# EasyEDA Pro project Avian.epro

# Schematic Avian

## Sheets
1 Power and sensors: Board Name: Avian; Create Date: 2026-01-17; Page Name: Power and sensors; Project Name: Avian; Schematic Name: Avian; Update Date: 2026-01-23; Company: EasyEDA.com; Page Size: A4; Version: V1.0
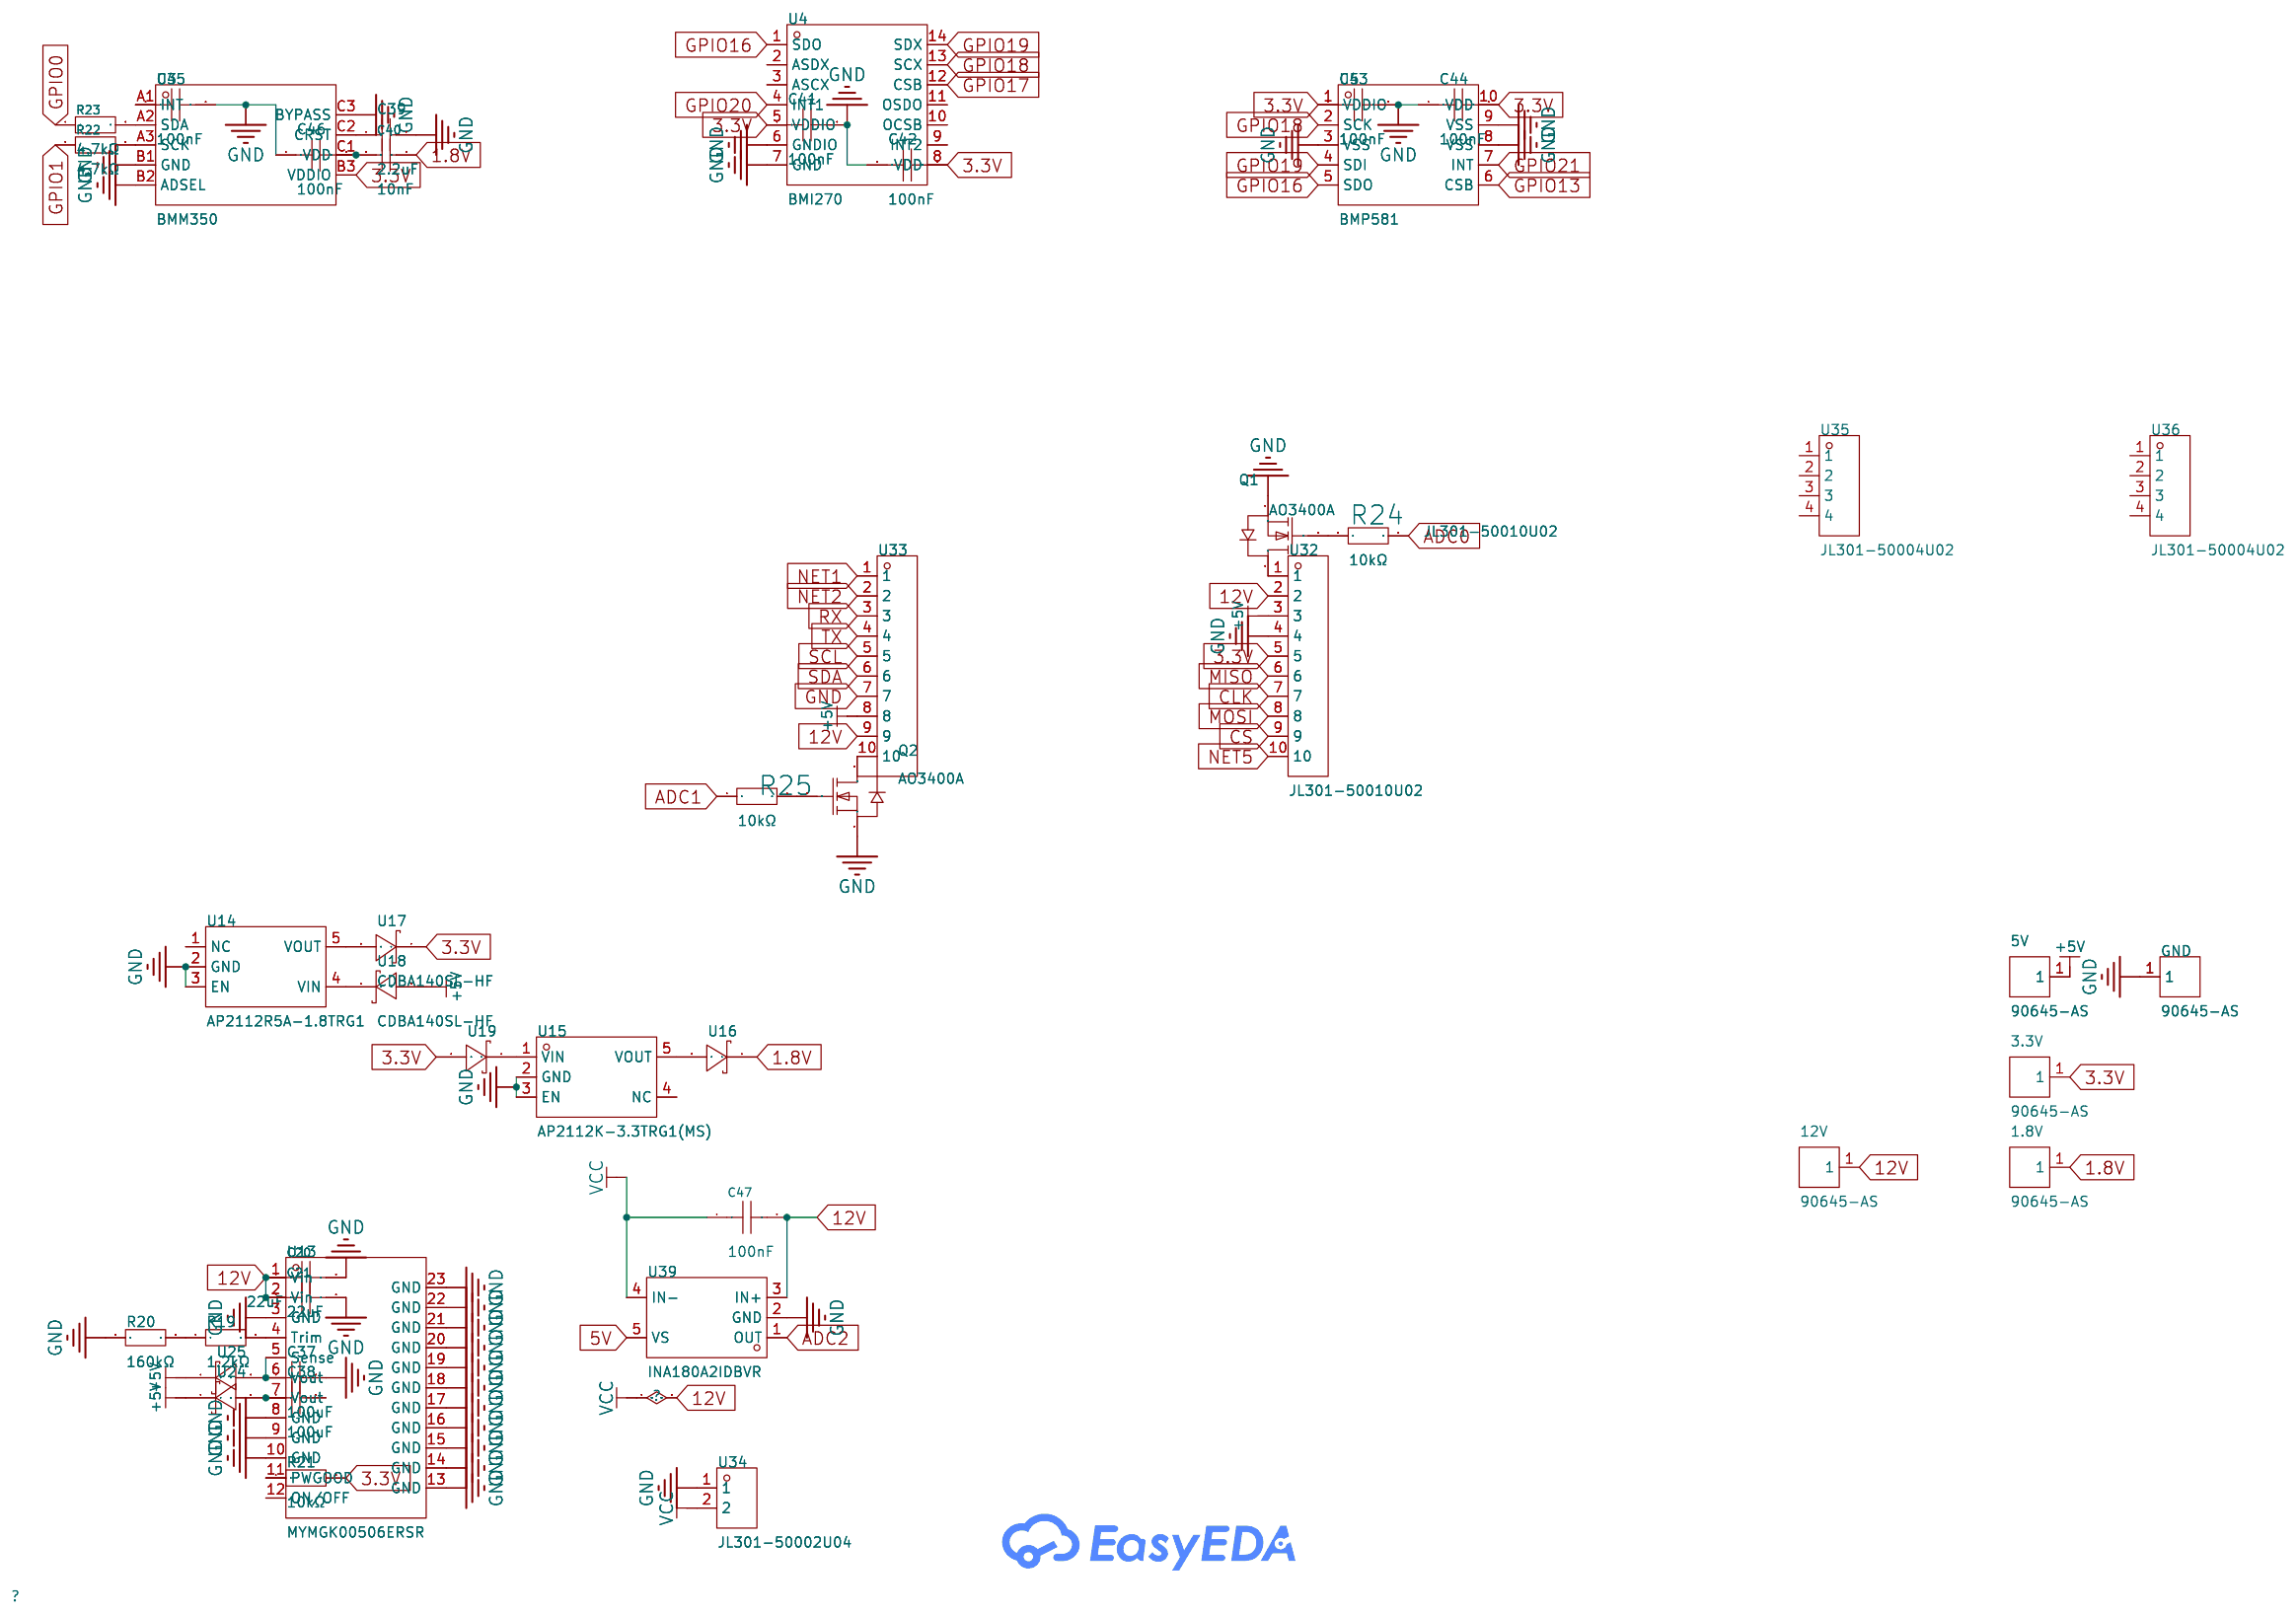
[diagram p0: Power and sensors]
2 MRPI: Create Date: 2026-01-18; Page Name: MRPI
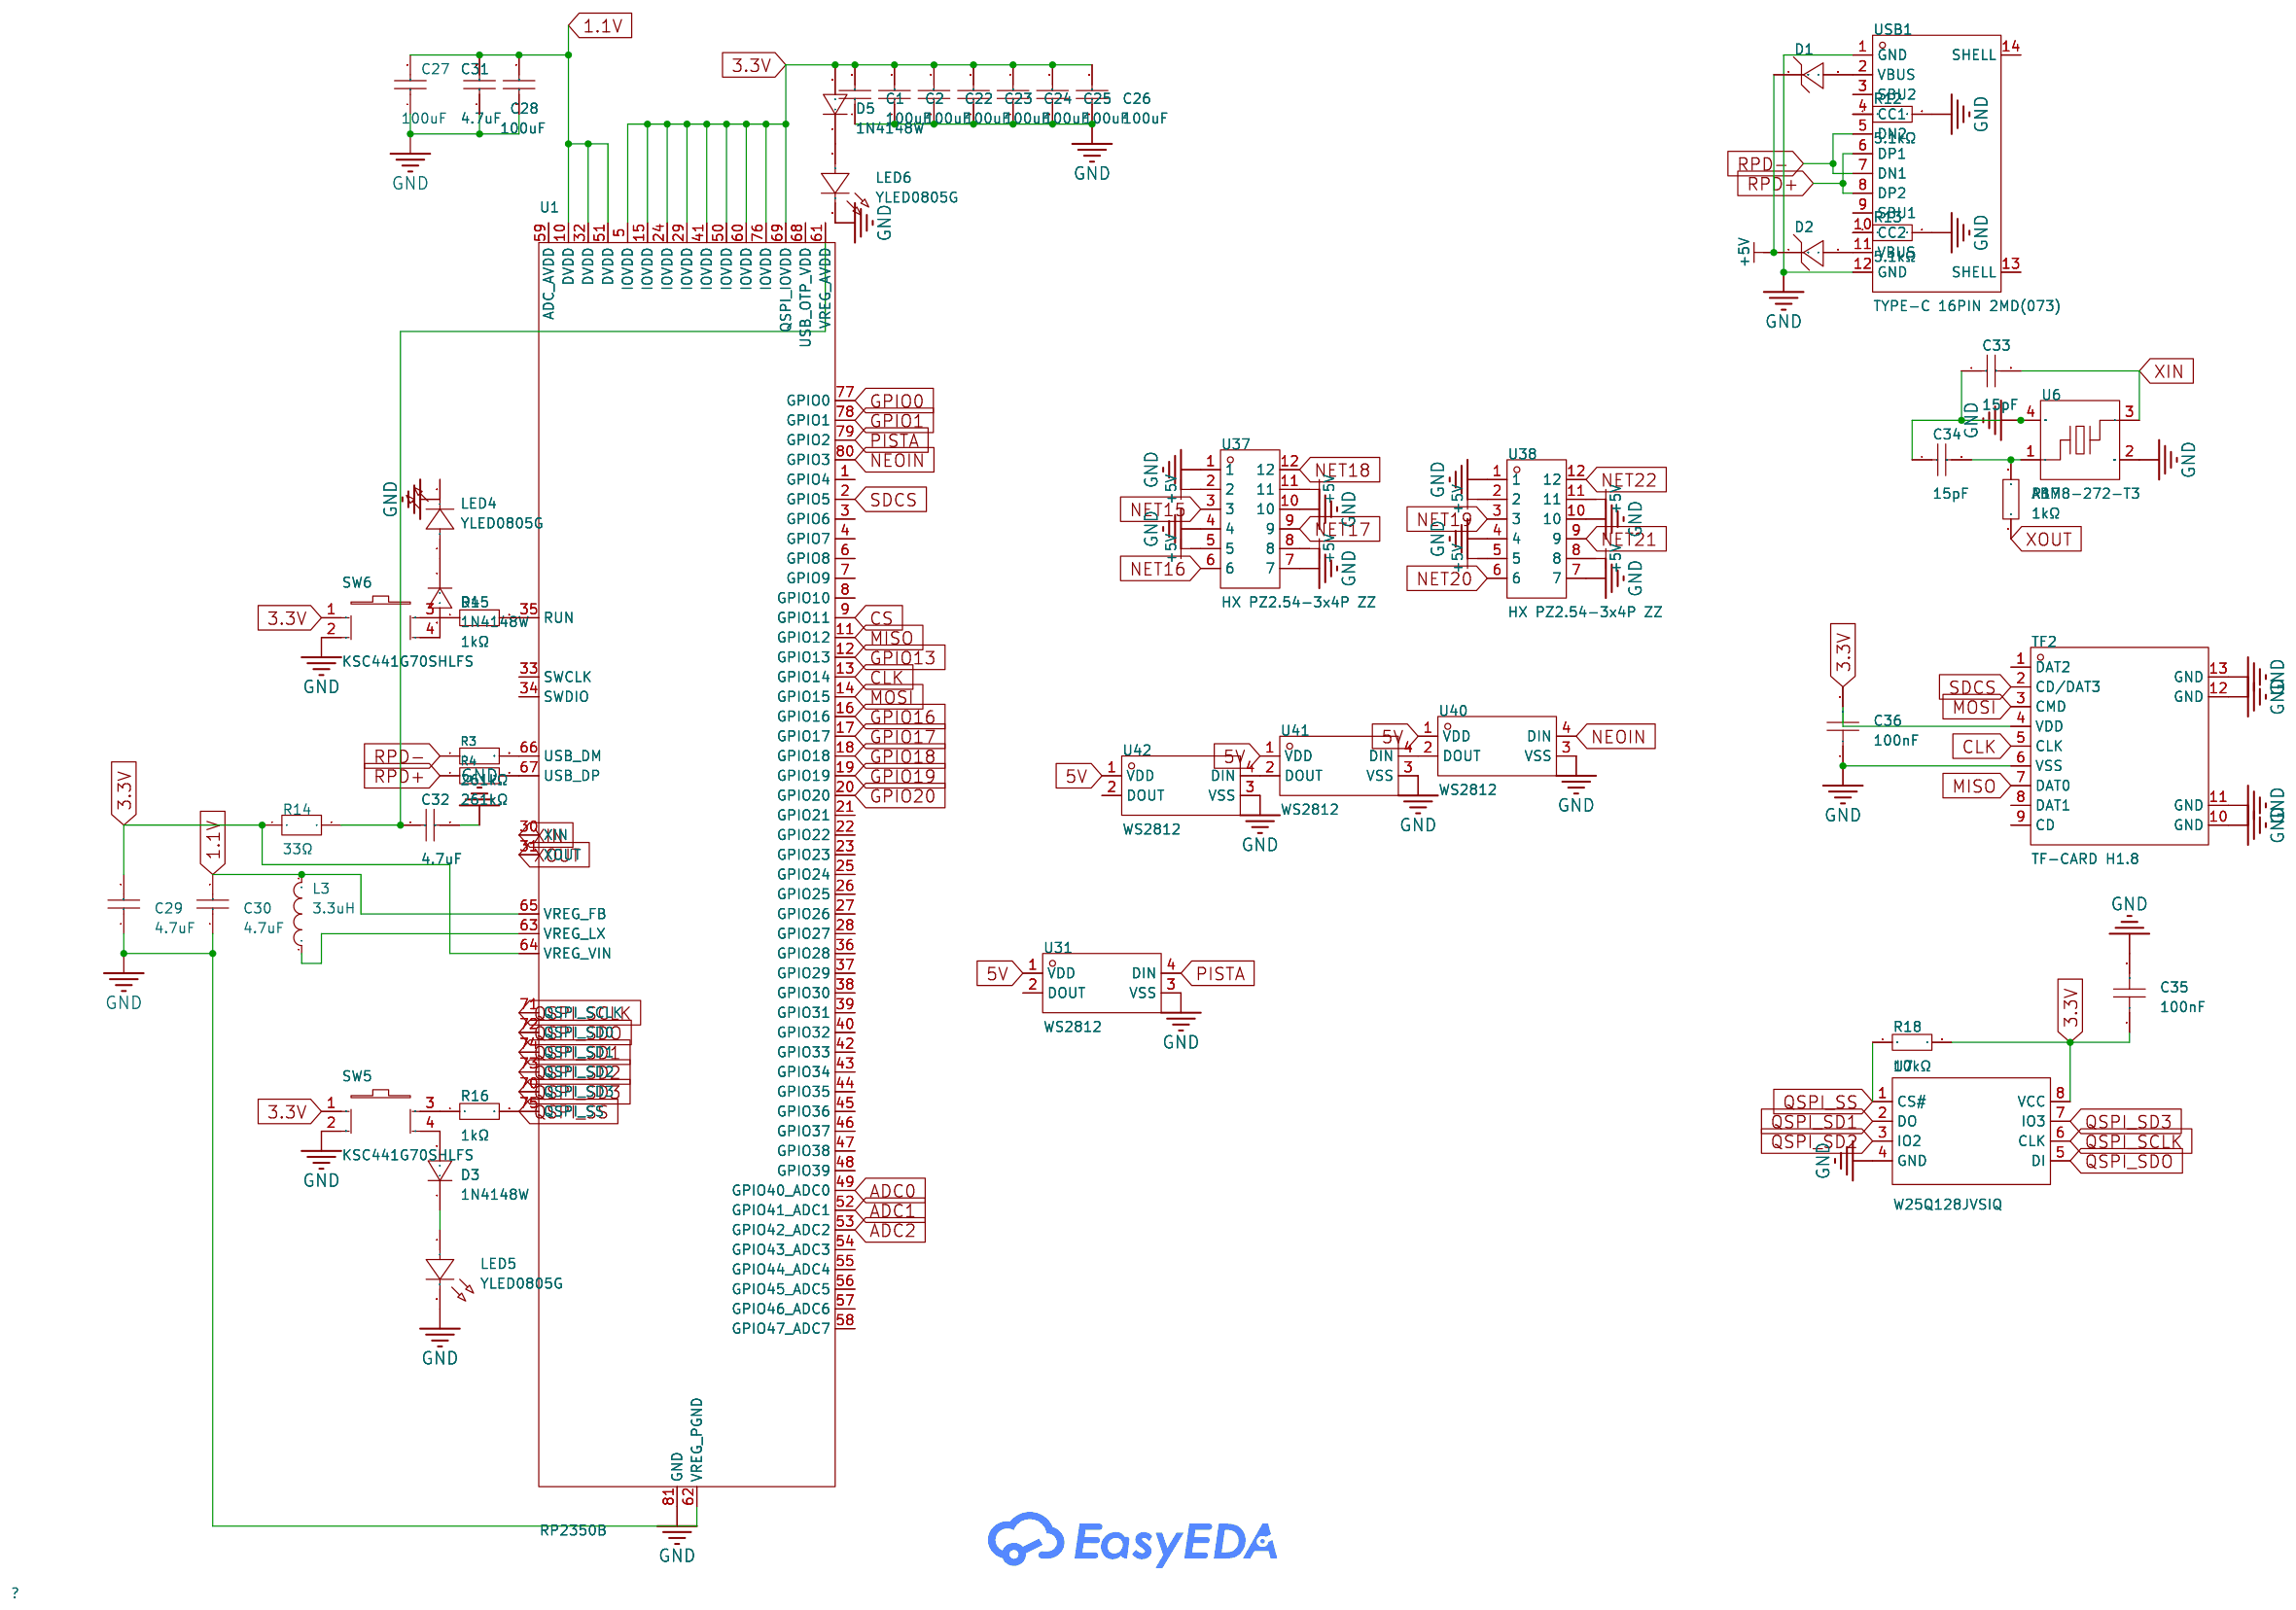
[diagram p1: MRPI]

## Parts
sheet MRPI
C1  100uF  [C1206]
C2  100uF  [C1206]
C22  100uF  [C1206]
C23  100uF  [C1206]
C24  100uF  [C1206]
C25  100uF  [C1206]
C26  100uF  [C1206]
C27  100uF  [C1206]
C28  100uF  [C1206]
C29  4.7uF  [C1206]
C30  4.7uF  [C1206]
C31  4.7uF  [C1206]
C32  4.7uF  [C1206]
C33  15pF  [C0603]
C34  15pF  [C0603]
C35  100nF  [C0603]
C36  100nF  [C0603]
D1  5.6V稳压管  [LL-34_L3.5-W1.5-RD]
D2  5.6V稳压管  [LL-34_L3.5-W1.5-RD]
D3  1N4148W  [SOD-123F_L2.7-W1.6-LS3.8-RD]
D4  1N4148W  [SOD-123F_L2.7-W1.6-LS3.8-RD]
D5  1N4148W  [SOD-123F_L2.7-W1.6-LS3.8-RD]
L3  3.3uH  [IND-SMD_L2.0-W1.6_AOTA-B201610S3R3-101-T]
LED4  YLED0805G  [LED0805-FD-GREEN]
LED5  YLED0805G  [LED0805-FD-GREEN]
LED6  YLED0805G  [LED0805-FD-GREEN]
R3  261kΩ  [R0603]
R4  261kΩ  [R0603]
R12  5.1kΩ  [R0805]
R13  5.1kΩ  [R0805]
R14  33Ω  [R0603]
R15  1kΩ  [R0603]
R16  1kΩ  [R0603]
R17  1kΩ  [R0603]
R18  10kΩ  [R0603]
SW5  KSC441G70SHLFS  [KEY--SMD_4P-L6.2-W6.2-P4.50-LS12.0]
SW6  KSC441G70SHLFS  [KEY--SMD_4P-L6.2-W6.2-P4.50-LS12.0]
TF2  TF-CARD H1.8  [TF-SMD_TF-CARD-H1.8]
U1  RP2350B  [QFN-80_L10.0-W10.0-P0.40-TL-EP3.4]
U6  ABM8-272-T3  [CRYSTAL-SMD_4P-L3.2-W2.5-BL]
U7  W25Q128JVSIQ  [SOIC-8_L5.3-W5.3-P1.27-LS8.0-BL]
U31  WS2812  [LED-SMD_4P-L5.0-W5.0-TL-A]
U37  HX PZ2.54-3x4P ZZ  [HDR-TH_12P-P2.54-V-M-R3-C4-S2.54]
U38  HX PZ2.54-3x4P ZZ  [HDR-TH_12P-P2.54-V-M-R3-C4-S2.54]
U40  WS2812  [LED-SMD_4P-L5.0-W5.0-TL-A]
U41  WS2812  [LED-SMD_4P-L5.0-W5.0-TL-A]
U42  WS2812  [LED-SMD_4P-L5.0-W5.0-TL-A]
USB1  TYPE-C 16PIN 2MD(073)  [USB-C-SMD_TYPE-C-6PIN-2MD-073]
sheet Power and sensors
1.8V  90645-AS  [SMD_BD1.8-H8.0]
3.3V  90645-AS  [SMD_BD1.8-H8.0]
5V  90645-AS  [SMD_BD1.8-H8.0]
12V  90645-AS  [SMD_BD1.8-H8.0]
C20  22uF  [C1210]
C21  22uF  [C1210]
C37  100uF  [C1206]
C38  100uF  [C1206]
C39  2.2uF  [C1206]
C40  10nF  [C0603]
C41  100nF  [C0603]
C42  100nF  [C0603]
C43  100nF  [C0603]
C44  100nF  [C0603]
C45  100nF  [C0603]
C46  100nF  [C0603]
C47  100nF  [C0603]
GND  90645-AS  [SMD_BD1.8-H8.0]
Q1  AO3400A  [SOT-23-3_L2.9-W1.3-P1.90-LS2.4-BR]
Q2  AO3400A  [SOT-23-3_L2.9-W1.3-P1.90-LS2.4-BR]
R19  1.2kΩ  [R0805]
R20  160kΩ  [R0603]
R21  10kΩ  [R0603]
R22  4.7kΩ  [R1206]
R23  4.7kΩ  [R1206]
R24  10kΩ  [R0603]
R25  10kΩ  [R0603]
U3  BMM350  [WLCSP-9_L1.3-W1.3-R3-C3-P0.40-TL]
U4  BMI270  [LGA-14_L3.0-W2.5-P0.50-BR]
U5  BMP581  [LGA-10_L2.0-W2.0-P0.50-TL_BMP581]
U13  MYMGK00506ERSR  [LGA-23_L9.0-W7.5_MYMGK00506ERSR]
U14  AP2112R5A-1.8TRG1  [SOT-89-5_L4.5-W2.5-P1.50-LS4.5-BR]
U15  AP2112K-3.3TRG1(MS)  [SOT-23-5_L2.9-W1.6-P0.95-LS2.7-BR]
U16  CDBA140SL-HF  [DO-214AC_L4.3-W2.7-LS5.3-RD]
U17  CDBA140SL-HF  [DO-214AC_L4.3-W2.7-LS5.3-RD]
U18  CDBA140SL-HF  [DO-214AC_L4.3-W2.7-LS5.3-RD]
U19  CDBA140SL-HF  [DO-214AC_L4.3-W2.7-LS5.3-RD]
U24  CDBA140SL-HF  [DO-214AC_L4.3-W2.7-LS5.3-RD]
U25  CDBA140SL-HF  [DO-214AC_L4.3-W2.7-LS5.3-RD]
U32  JL301-50010U02  [CONN-TH_10P-P5.00_JL301-50010U02]
U33  JL301-50010U02  [CONN-TH_10P-P5.00_JL301-50010U02]
U34  JL301-50002U04  [CONN-TH_JL301-50002U01]
U35  JL301-50004U02  [CONN-TH_4P-P5.00_JL301-50004U02]
U36  JL301-50004U02  [CONN-TH_4P-P5.00_JL301-50004U02]
U39  INA180A2IDBVR  [SOT-23-5_L3.0-W1.7-P0.95-LS2.8-BL]

## Library data of the parts
C1 C2 C22-C28 C37 C38 = CL31A107MQHNNNE: Capacitance:100uF Tolerance:±20% Tolerance:±20% Voltage Rating:6.3V Temperature Coefficient:X5R; LCSC Part Name: 100uF ±20% 6.3V; Supplier Part: C15008; Manufacturer: SAMSUNG(三星); Supplier Footprint: 1206; Datasheet: https://item.szlcsc.com/datasheet/CL31A107MQHNNNE/15681.html; Supplier: LCSC; Tolerance: ±20%; Voltage Rating: 6.3V; Temperature Coefficient: X5R
C29-C32 = CL31B475KBHNNNE: Capacitance:4.7uF Tolerance:±10% Tolerance:±10% Voltage Rating:50V Temperature Coefficient:X7R; LCSC Part Name: 4.7uF ±10% 50V; Supplier Part: C51205; Manufacturer: SAMSUNG(三星); Supplier Footprint: 1206; Datasheet: https://item.szlcsc.com/datasheet/CL31B475KBHNNNE/52218.html; Supplier: LCSC; Tolerance: ±10%; Voltage Rating: 50V; Temperature Coefficient: X7R
C33 C34 = CL10C150JB8NNNC: Capacitance:15pF Tolerance:±5% Tolerance:±5% Voltage Rating:50V Temperature Coefficient:C0G; LCSC Part Name: 15pF ±5% 50V; Supplier Part: C1644; Manufacturer: SAMSUNG(三星); Supplier Footprint: 0603; JLCPCB Part Class: Basic Part; Datasheet: https://item.szlcsc.com/datasheet/CL10C150JB8NNNC/1996.html; Supplier: LCSC; Tolerance: ±5%; Voltage Rating: 50V; Temperature Coefficient: C0G
C35 C36 C41-C46 = CC0603KRX7R9BB104: Capacitance:100nF Tolerance:±10% Tolerance:±10% Voltage Rating:50V Temperature Coefficient:X7R; LCSC Part Name: 100nF ±10% 50V; Supplier Part: C14663; Manufacturer: YAGEO(国巨); Supplier Footprint: 0603; Datasheet: https://item.szlcsc.com/datasheet/CC0603KRX7R9BB104/15331.html; Supplier: LCSC; Tolerance: ±10%; Voltage Rating: 50V; Temperature Coefficient: X7R
D1 D2 = 5.6V稳压管: Supplier Part: C9900004788; Supplier Footprint: LL34_L3.5-1.5; JLCPCB Part Class: Extended Part; Supplier: LCSC
D3-D5 = 1N4148W_C81598: Diode Configuration:Independent Voltage - Forward(Vf@If):1V@50mA Voltage - DC Reverse(Vr):75V Current - Rectified:150mA Pd - Power Dissipation:400mW Reverse Leakage Current (Ir):1uA@75V Reverse Recovery Time (trr):4ns Operating Junction Temperature Range:; Supplier Part: C81598; Manufacturer: ST(先科); Supplier Footprint: SOD-123; JLCPCB Part Class: Basic Part; Datasheet: https://item.szlcsc.com/datasheet/1N4148W/82750.html; Supplier: LCSC; Diode Configuration: Independent; Voltage - Forward(Vf@If): 1V@50mA; Voltage - DC Reverse(Vr): 75V; Current - Rectified: 150mA; Pd - Power Dissipation: 400mW; Reverse Leakage Current (Ir): 1uA@75V; Reverse Recovery Time (trr): 4ns; Non-Repetitive Peak Forward Surge Current: 1A
L3 = AOTA-B201610S3R3-101-T: Inductance:3.3uH Current Rating:2.1A Current - Saturation(Isat):2.4A DC Resistance(DCR):115mΩ Type:Molded Inductor; LCSC Part Name: 3.3uH 2.4A; Supplier Part: C42411119; Manufacturer: ABRACON; Supplier Footprint: 0806; JLCPCB Part Class: Extended Part; Datasheet: https://item.szlcsc.com/datasheet/AOTA-B201610S3R3-101-T/44392932.html; Supplier: LCSC; Current Rating: 2.1A; Current - Saturation(Isat): 2.4A; DC Resistance(DCR): 115mΩ; Type: Molded Inductor
LED4-LED6 = YLED0805G: Lamp Holder Type:-；- Illumination Color:Emerald Green Voltage - Forward(Vf):2.4V~3.1V Voltage - Forward(Vf):2.4V~3.1V Power(Watts):70mW Forward Current:20mA Wavelength - Dominant:516nm~534nm Wavelength - Dominant:516nm~534nm Peak Wavelength:525nm Diode Co; LCSC Part Name: 发光管; Supplier Part: C25170728; Manufacturer: YONGYUTAI(永裕泰); Supplier Footprint: 0805; JLCPCB Part Class: Extended Part; Datasheet: https://item.szlcsc.com/datasheet/YLED0805G/26899175.html; Supplier: LCSC; Lamp Holder Type: -；-; Illumination Color: Emerald Green; Voltage - Forward(Vf): 2.4V~3.1V; Power(Watts): 70mW; Forward Current: 20mA; Wavelength - Dominant: 516nm~534nm; Peak Wavelength: 525nm; Diode Configuration: -；-; Lens Color: -；-; Luminous Intensity: 430mcd; Viewing Angle: 120°; Mounting Style: -；-; Operating Temperature: -40℃~+85℃
R3 R4 = 0603WAF2613T5E: Type:Thick Film Resistors Resistance:261kΩ Tolerance:±1% Tolerance:±1% Power(Watts): Overload Voltage (Max): Temperature Coefficient:±100ppm/℃ Temperature Coefficient:±100ppm/℃ Operating Temperature Range:-55℃~+155℃ Operating Temperature Range:-55℃~+155℃; LCSC Part Name: 261kΩ ±1% 100mW 厚膜电阻; Supplier Part: C23011; Manufacturer: UNI-ROYAL(厚声); Supplier Footprint: 0603; JLCPCB Part Class: Extended Part; Datasheet: https://atta.szlcsc.com/upload/public/pdf/source/20200306/C422600_1E6D84923E4A46A82E41ADD87F860B5C.pdf; Supplier: LCSC; Type: Thick Film Resistors; Tolerance: ±1%; Temperature Coefficient: ±100ppm/℃; Operating Temperature Range: -55℃~+155℃
R12 R13 = 0805W8F5101T5E: Type:Thick Film Resistor Resistance:5.1kΩ Tolerance:±1% Tolerance:±1% Power(Watts):125mW Voltage-Supply(Max):150V Temperature Coefficient:±100ppm/℃ Temperature Coefficient:±100ppm/℃ Operating Temperature:-55℃~+155℃ Operating Temperature:-55℃~+155℃; LCSC Part Name: 5.1kΩ ±1% 125mW 厚膜电阻; Supplier Part: C27834; Manufacturer: UNI-ROYAL(厚声); Supplier Footprint: 0805; JLCPCB Part Class: Basic Part; Datasheet: https://item.szlcsc.com/datasheet/0805W8F5101T5E/28584.html; Supplier: LCSC; Type: Thick Film Resistor; Tolerance: ±1%; Power(Watts): 125mW; Voltage-Supply(Max): 150V; Temperature Coefficient: ±100ppm/℃; Operating Temperature: -55℃~+155℃
R14 = FRC0603F33R0TS: Type:Thick Film Resistor Resistance:33Ω Tolerance:±1% Tolerance:±1% Power(Watts):100mW Voltage-Supply(Max):75V Temperature Coefficient:±100ppm/℃ Temperature Coefficient:±100ppm/℃ Operating Temperature:-55℃~+155℃ Operating Temperature:-55℃~+155℃; LCSC Part Name: 33Ω ±1% 100mW 厚膜电阻; Supplier Part: C2909394; Manufacturer: FOJAN(富捷); Supplier Footprint: 0603; JLCPCB Part Class: Extended Part; Supplier: LCSC; Type: Thick Film Resistor; Tolerance: ±1%; Power(Watts): 100mW; Voltage-Supply(Max): 75V; Temperature Coefficient: ±100ppm/℃; Operating Temperature: -55℃~+155℃
R15-R17 = RC0603FR-071KL: Type:Thick Film Resistor Resistance:1kΩ Tolerance:±1% Tolerance:±1% Power(Watts):100mW Voltage-Supply(Max):75V Temperature Coefficient:±100ppm/℃ Temperature Coefficient:±100ppm/℃ Operating Temperature:-55℃~+155℃ Operating Temperature:-55℃~+155℃; LCSC Part Name: 厚膜电阻 1kΩ ±1% 100mW; Supplier Part: C22548; Manufacturer: YAGEO(国巨); Supplier Footprint: 0603; JLCPCB Part Class: Extended Part; Datasheet: https://item.szlcsc.com/datasheet/RC0603FR-071KL/23274.html; Supplier: LCSC; Type: Thick Film Resistor; Tolerance: ±1%; Power(Watts): 100mW; Voltage-Supply(Max): 75V; Temperature Coefficient: ±100ppm/℃; Operating Temperature: -55℃~+155℃
R18 R21 = RC0603FR-0710KL: Type:Thick Film Resistors Resistance: Tolerance:±1% Tolerance:±1% Power(Watts): Overload Voltage (Max): Temperature Coefficient:±100ppm/℃ Temperature Coefficient:±100ppm/℃ Operating Temperature Range:-55℃~+155℃ Operating Temperature Range:-55℃~+155℃; LCSC Part Name: 厚膜电阻 10kΩ ±1% 100mW; Supplier Part: C98220; Manufacturer: YAGEO(国巨); Supplier Footprint: 0603; JLCPCB Part Class: Extended Part; Datasheet: https://atta.szlcsc.com/upload/public/pdf/source/20180927/C295883_E8D83085EA81BD7DE0B2B681138C15EE.pdf; Supplier: LCSC; Type: Thick Film Resistors; Tolerance: ±1%; Temperature Coefficient: ±100ppm/℃; Operating Temperature Range: -55℃~+155℃
SW5 SW6 = KSC441G70SHLFS: Circuit:SPST Actuator Style:Round Button Operating Force:4N Mounting Type:Surface Mount,Vertical Length:6.2mm Width:6.2mm Switch Height:5.2mm Contact Current:50mA Voltage Rating:32V With Lamp:- IP Rating:IP67 Termination Style:Gull Wing Life:- Operating T; LCSC Part Name: 轻触开关6.2mm*6.2mm，4N; Supplier Part: C221747; Manufacturer: C&K; Supplier Footprint: SMD-4P,6.2x6.2mm; JLCPCB Part Class: Extended Part; Datasheet: https://item.szlcsc.com/datasheet/KSC441G70SHLFS/222177.html; Supplier: LCSC; Circuit: SPST; Actuator Style: Round Button; Operating Force: 4N; Mounting Type: Surface Mount,Vertical; Length: 6.2mm; Width: 6.2mm; Switch Height: 5.2mm; Contact Current: 50mA; Voltage Rating: 32V; IP Rating: IP67; Termination Style: Gull Wing; Operating Temperature: -40℃~+85℃
TF2 = TF-CARD H1.8: Card Connection Mode:Push-Push Card Type:MicroSD Card (TF Card) Connector Type:Connector and Ejector Additional Card Detection Pins:- Supplementary Features:- Height Above Board:1.8mm Operating Temperature:-40℃~+70℃ Operating Temperature:-40℃~+70℃; LCSC Part Name: 自弹式 MicroSD卡(TF卡) 卡座; Supplier Part: C7529389; Manufacturer: SHOU HAN(首韩); Supplier Footprint: SMD; Datasheet: https://item.szlcsc.com/datasheet/TF-CARD%2520H1.8/8629776.html; Supplier: LCSC; Card Connection Mode: Push-Push; Card Type: MicroSD Card (TF Card); Connector Type: Connector and Ejector; Height Above Board: 1.8mm; Operating Temperature: -40℃~+70℃
U1 = RP2350B_C42415655: LCSC Part Name: 微控制器; Supplier Part: C42415655; Manufacturer: Raspberry Pi(树莓派); Supplier Footprint: QFN-80-EP(10x10); JLCPCB Part Class: Extended Part; Datasheet: https://item.szlcsc.com/datasheet/RP2350B/44413055.html; Supplier: LCSC
U6 = ABM8-272-T3_C20625731: Supplier Part: C20625731; Manufacturer: ABRACON; Supplier Footprint: SMD3225-4P; JLCPCB Part Class: Extended Part; Datasheet: https://item.szlcsc.com/datasheet/ABM8-272-T3/22032038.html; Supplier: LCSC
U7 = W25Q128JVSIQ: Interface:SPI Memory Size:128Mbit Clock Frequency:133MHz Voltage - Supply:2.7V~3.6V Voltage - Supply:2.7V~3.6V Standby Supply Current:1uA Program / Erase Cycles:100,000 Cycles Page Programming Time (Tpp):3ms Block Erase Time(tBE):120ms@(32KB) Data Retenti; LCSC Part Name: 编带 支持双路/四路SPI接口的3V、128Mbit 串行闪存; Supplier Part: C97521; Manufacturer: Winbond(华邦); Supplier Footprint: SOIC-8-208mil; JLCPCB Part Class: Basic Part; Datasheet: https://item.szlcsc.com/datasheet/W25Q128JVSIQ/98729.html; Supplier: LCSC; Interface: SPI; Memory Size: 128Mbit; Clock Frequency: 133MHz; Voltage - Supply: 2.7V~3.6V; Standby Supply Current: 1uA; Program / Erase Cycles: 100,000 Cycles; Page Programming Time (Tpp): 3ms; Block Erase Time(tBE): 120ms@(32KB); Data Retention - TDR (Year): 20 Years; Operating Temperature: -40℃~+85℃
U31 U40-U42 = WS2812: Supplier Part: C42417498; Manufacturer: worldsemi; Supplier Footprint: SMD5050-4P; JLCPCB Part Class: Extended Part; Datasheet: https://item.szlcsc.com/datasheet/WS2812/44423158.html; Supplier: LCSC
U37 U38 = HX PZ2.54-3x4P ZZ: Pin Structure:3x4P Pitch:2.54mm Row Spacing:2.54mm Circluar Pins/Square Pins:Pin Header Mounting Type:Through Hole Number of Rows:3 Number of Pins:12P Current Rating:3A Voltage Rating (Max):1kV Length of Mating Pin:6mm Insulation Height:2.5mm Length of En; LCSC Part Name: 3x4P 间距:2.54mm 方针 直插; Supplier Part: C32713291; Manufacturer: hanxia(韩下); Supplier Footprint: 插件,P=2.54mm; JLCPCB Part Class: Extended Part; Datasheet: https://item.szlcsc.com/datasheet/HX%2520PZ2.54-3x4P%2520ZZ/34444571.html; Supplier: LCSC; Pin Structure: 3x4P; Pitch: 2.54mm; Row Spacing: 2.54mm; Circluar Pins/Square Pins: Pin Header; Mounting Type: Through Hole; Number of Rows: 3; Number of Pins: 12P; Current Rating: 3A; Voltage Rating (Max): 1kV; Length of Mating Pin: 6mm; Insulation Height: 2.5mm; Length of End Connection Pin: 3mm; Contact Material: Brass; Contact Plating: Gold; Operating Temperature: -40℃~+105℃; Color: Black
USB1 = TYPE-C 16PIN 2MD(073): Connector Type:Type-C Protocol Standard:- Gender:Female Mounting Type:Surface Mount, Right Angle Number of Contacts:16P Number of Ports:1 Current Rating-Power:3A Voltage Rating:5V Connect-Disconnect Life:5,000 Cycles Supplementary Features:- Center Height; LCSC Part Name: Type-C 母 卧贴; Supplier Part: C2765186; Manufacturer: SHOU HAN(首韩); Supplier Footprint: SMD; Datasheet: https://item.szlcsc.com/datasheet/TYPE-C%252016PIN%25202MD(073)/2901843.html; Supplier: LCSC; Connector Type: Type-C; Gender: Female; Mounting Type: Surface Mount, Right Angle; Number of Contacts: 16P; Number of Ports: 1; Current Rating-Power: 3A; Voltage Rating: 5V; Connect-Disconnect Life: 5,000 Cycles; Detection color: Black; Operating Temperature: -25℃~+85℃
1.8V 3.3V 5V 12V GND = 90645-AS: Supplier Part: C9900180202; Supplier Footprint: PAD; Supplier: LCSC
C20 C21 = GRM32ER71E226KE15L: Capacitance: Tolerance:±10% Tolerance:±10% Voltage Rated: Temperature Coefficient:; LCSC Part Name: 22uF ±10% 25V; Supplier Part: C21397; Manufacturer: muRata(村田); Supplier Footprint: 1210; JLCPCB Part Class: Extended Part; Datasheet: https://atta.szlcsc.com/upload/public/pdf/source/20230811/6AA9DB9766E5496748A2F980D0C94A94.pdf; Supplier: LCSC; Tolerance: ±10%
C39 = CL31B225KBHNNNE: Capacitance:2.2uF Tolerance:±10% Tolerance:±10% Voltage Rating:50V Temperature Coefficient:X7R; LCSC Part Name: 2.2uF ±10% 50V; Supplier Part: C50254; Manufacturer: SAMSUNG(三星); Supplier Footprint: 1206; Datasheet: https://item.szlcsc.com/datasheet/CL31B225KBHNNNE/51263.html; Supplier: LCSC; Tolerance: ±10%; Voltage Rating: 50V; Temperature Coefficient: X7R
C40 = CC0603KRX7R9BB103: Capacitance:10nF Tolerance:±10% Tolerance:±10% Voltage Rating:50V Temperature Coefficient:X7R; LCSC Part Name: 10nF ±10% 50V; Supplier Part: C100042; Manufacturer: YAGEO(国巨); Supplier Footprint: 0603; JLCPCB Part Class: Extended Part; Datasheet: https://item.szlcsc.com/datasheet/CC0603KRX7R9BB103/101256.html; Supplier: LCSC; Tolerance: ±10%; Voltage Rating: 50V; Temperature Coefficient: X7R
C47 = CL10B104KB8NNNC: Capacitance:100nF Tolerance:±10% Tolerance:±10% Voltage Rating:50V Temperature Coefficient:X7R; LCSC Part Name: 100nF ±10% 50V; Supplier Part: C1591; Manufacturer: SAMSUNG(三星); Supplier Footprint: 0603; JLCPCB Part Class: Extended Part; Datasheet: https://item.szlcsc.com/datasheet/CL10B104KB8NNNC/1943.html; Supplier: LCSC; Tolerance: ±10%; Voltage Rating: 50V; Temperature Coefficient: X7R
Q1 Q2 = AO3400A_C20917: Number:- Drain to Source Voltage:30V Current - Continuous Drain(Id):- RDS(on):48mΩ@2.5V Pd - Power Dissipation:- Gate Threshold Voltage (Vgs(th)):1.45V@250uA Gate Charge(Qg):7nC@10V Input Capacitance(Ciss):630pF@15V Reverse Transfer Capacitance (Crss@Vds); LCSC Part Name: 1个N沟道 耐压:30V 电流:5.7A; Supplier Part: C20917; Manufacturer: AOS; Supplier Footprint: SOT-23-3L; JLCPCB Part Class: Basic Part; Datasheet: https://item.szlcsc.com/datasheet/AO3400A/21629.html; Supplier: LCSC; Drain to Source Voltage: 30V; RDS(on): 48mΩ@2.5V; Gate Threshold Voltage (Vgs(th)): 1.45V@250uA; Gate Charge(Qg): 7nC@10V; Input Capacitance(Ciss): 630pF@15V; Operating Temperature: -55℃~+150℃@(Tj); Type: N-Channel
R19 = RC0805FR-071K2L: Type:Thick Film Resistors Resistance: Tolerance:±1% Tolerance:±1% Power(Watts): Overload Voltage (Max): Temperature Coefficient:±100ppm/℃ Temperature Coefficient:±100ppm/℃ Operating Temperature Range:-55℃~+155℃ Operating Temperature Range:-55℃~+155℃; LCSC Part Name: 厚膜电阻 1.2kΩ ±1% 125mW; Supplier Part: C114526; Manufacturer: YAGEO(国巨); Supplier Footprint: 0805; JLCPCB Part Class: Extended Part; Datasheet: https://atta.szlcsc.com/upload/public/pdf/source/20180821/C275644_0D56F95EFF785E7D9A1FEF436B37DA78.pdf; Supplier: LCSC; Type: Thick Film Resistors; Tolerance: ±1%; Temperature Coefficient: ±100ppm/℃; Operating Temperature Range: -55℃~+155℃
R20 = 0603WAF1603T5E: Type:Thick Film Resistor Resistance:160kΩ Tolerance:±1% Tolerance:±1% Power(Watts):100mW Voltage-Supply(Max):75V Temperature Coefficient:±100ppm/℃ Temperature Coefficient:±100ppm/℃ Operating Temperature:-55℃~+155℃ Operating Temperature:-55℃~+155℃; LCSC Part Name: 160kΩ ±1% 100mW 厚膜电阻; Supplier Part: C22813; Manufacturer: UNI-ROYAL(厚声); Supplier Footprint: 0603; Datasheet: https://item.szlcsc.com/datasheet/0603WAF1603T5E/23540.html; Supplier: LCSC; Type: Thick Film Resistor; Tolerance: ±1%; Power(Watts): 100mW; Voltage-Supply(Max): 75V; Temperature Coefficient: ±100ppm/℃; Operating Temperature: -55℃~+155℃
R22 R23 = RMC12064.7K1%N: Type:Thick Film Resistor Resistance:4.7kΩ Tolerance:±1% Tolerance:±1% Power(Watts):250mW Voltage-Supply(Max):200V Temperature Coefficient:±100ppm/℃ Temperature Coefficient:±100ppm/℃ Operating Temperature:-55℃~+155℃ Operating Temperature:-55℃~+155℃; LCSC Part Name: 厚膜电阻 4.7kΩ ±1% 250mW; Supplier Part: C269592; Manufacturer: Tyohm(幸亚电阻); Supplier Footprint: 1206; JLCPCB Part Class: Extended Part; Datasheet: https://item.szlcsc.com/datasheet/RMC12064.7K1%2525N/259032.html; Supplier: LCSC; Type: Thick Film Resistor; Tolerance: ±1%; Power(Watts): 250mW; Voltage-Supply(Max): 200V; Temperature Coefficient: ±100ppm/℃; Operating Temperature: -55℃~+155℃
R24 R25 = 0603WAF1002T5E: Type:Thick Film Resistor Resistance:10kΩ Tolerance:±1% Tolerance:±1% Power(Watts):100mW Voltage-Supply(Max):75V Temperature Coefficient:±100ppm/℃ Temperature Coefficient:±100ppm/℃ Operating Temperature:-55℃~+155℃ Operating Temperature:-55℃~+155℃; LCSC Part Name: 厚膜电阻 10kΩ ±1% 100mW; Supplier Part: C25804; Manufacturer: UNI-ROYAL(厚声); Supplier Footprint: 0603; JLCPCB Part Class: Basic Part; Datasheet: https://item.szlcsc.com/datasheet/0603WAF1002T5E/26547.html; Supplier: LCSC; Type: Thick Film Resistor; Tolerance: ±1%; Power(Watts): 100mW; Voltage-Supply(Max): 75V; Temperature Coefficient: ±100ppm/℃; Operating Temperature: -55℃~+155℃
U3 = BMM350_C17225907: LCSC Part Name: BMM350 转接板 3.0; Supplier Part: C17225907; Manufacturer: Bosch(博世); Supplier Footprint: WLCSP-9(1.3x1.3); JLCPCB Part Class: Extended Part; Datasheet: https://item.szlcsc.com/datasheet/BMM350/18354996.html; Supplier: LCSC
U4 = BMI270: Sensor Type:加速度计陀螺仪 Operating Temperature:-40℃~+85℃ Operating Temperature:-40℃~+85℃; Supplier Part: C2836813; Manufacturer: Bosch(博世); Supplier Footprint: LGA-14(2.5x3); Datasheet: https://atta.szlcsc.com/upload/public/pdf/source/20210625/C2836813_35E1F3F92097F45A3828DF13DDBA01A5.pdf; Supplier: LCSC; Sensor Type: 加速度计陀螺仪; Operating Temperature: -40℃~+85℃
U5 = BMP581: Pressure range:30Kpa~1.25bar Pressure range:30Kpa~1.25bar Voltage - Supply:1.71V~3.6V Voltage - Supply:1.71V~3.6V Standby Current:1uA Interface:I3C；SpI；I2C Operating Temperature:-40℃~+85℃ Operating Temperature:-40℃~+85℃ Relative Accuracy:6pa Temperature C; LCSC Part Name: 气压传感器; Supplier Part: C5362283; Manufacturer: Bosch(博世); Supplier Footprint: LGA-10(2x2); JLCPCB Part Class: Extended Part; Datasheet: https://item.szlcsc.com/datasheet/BMP581/6186766.html; Supplier: LCSC; Pressure range: 30Kpa~1.25bar; Voltage - Supply: 1.71V~3.6V; Standby Current: 1uA; Interface: I3C；SpI；I2C; Operating Temperature: -40℃~+85℃; Relative Accuracy: 6pa; Temperature Coefficient of Offset(TCO): 0.5pa/K
U13 = MYMGK00506ERSR: Supplier Part: C9900017943; Supplier Footprint: SMD; JLCPCB Part Class: Extended Part; Supplier: LCSC
U14 = AP2112R5A-1.8TRG1: Output Type:Fixed Voltage - Supply:6V Output Voltage:1.8V Output Voltage:1.8V Output Current:600mA Power Supply Rejection Ratio (PSRR):65dB@(1kHz) Voltage Dropout:500mV@(600mA) standby current:55uA Noise:50uVrms Operating Temperature:-40℃~+85℃ Operating T; Supplier Part: C5552981; Manufacturer: DIODES(美台); Supplier Footprint: SOT-89-5; JLCPCB Part Class: Extended Part; Datasheet: https://item.szlcsc.com/datasheet/AP2112R5A-1.8TRG1/6469193.html; Supplier: LCSC; Output Type: Fixed; Voltage - Supply: 6V; Output Voltage: 1.8V; Output Current: 600mA; Power Supply Rejection Ratio (PSRR): 65dB@(1kHz); Voltage Dropout: 500mV@(600mA); standby current: 55uA; Noise: 50uVrms; Operating Temperature: -40℃~+85℃; Output Configuration: Positive; Number of Outputs: 1
U15 = AP2112K-3.3TRG1(MS): Output Type:Fixed Voltage - Supply:6V Output Voltage:3.3V Output Voltage:3.3V Output Current:600mA Power Supply Rejection Ratio (PSRR):75dB@(1kHz) Voltage Dropout:- standby current:2uA Noise:- Features:Automatic Discharge Function；Low ESR；Overheat protect; Supplier Part: C22365427; Manufacturer: MSKSEMI(美森科); Supplier Footprint: SOT-23-5; Datasheet: https://item.szlcsc.com/datasheet/AP2112K-3.3TRG1(MS)/23832169.html; Supplier: LCSC; Output Type: Fixed; Voltage - Supply: 6V; Output Voltage: 3.3V; Output Current: 600mA; Power Supply Rejection Ratio (PSRR): 75dB@(1kHz); standby current: 2uA; Features: Automatic Discharge Function；Low ESR；Overheat protection；Overcurrent Protection；With ability; Operating Temperature: -40℃~+125℃@(Tj); Output Configuration: Positive electrode; Number of Outputs: 1
U16-U19 U24 U25 = CDBA140SL-HF: Diode Configuration:Independent Type Forward Voltage (Vf@If):270mV@1A Reverse Voltage (Vr):40V Rectified Current:1A Reverse Leakage Current (Ir):200uA@40V; LCSC Part Name: 电压:40V 电流:1A; Supplier Part: C3012747; Manufacturer: Comchip(典琦); Supplier Footprint: SMA(DO-214AC); JLCPCB Part Class: Extended Part; Datasheet: https://atta.szlcsc.com/upload/public/pdf/source/20220509/162A5C6B49991143F34B2FD163CA218E.pdf; Supplier: LCSC; Diode Configuration: Independent Type; Forward Voltage (Vf@If): 270mV@1A; Reverse Voltage (Vr): 40V; Rectified Current: 1A; Reverse Leakage Current (Ir): 200uA@40V
U32 U33 = JL301-50010U02: Number of Positions or Pins:1x10P Pitch:5mm Color:Blue Mounting Type:Through Hole Number of Pins:10P Number of Rows:1 Number of PINs Per Row:10 Screw Specification:M2.5 Current Rating:15A Voltage Rating (Max):300V Wire Gauge - AWG:12~24 Operating Temperat; LCSC Part Name: 1x10P 5mm 直插 排数:1 每排P数:10; Supplier Part: C409141; Manufacturer: JILN(锦凌); Supplier Footprint: 插件,P=5mm; JLCPCB Part Class: Extended Part; Datasheet: https://item.szlcsc.com/datasheet/JL301-50010U02/399071.html; Supplier: LCSC; Number of Positions or Pins: 1x10P; Pitch: 5mm; Color: Blue; Mounting Type: Through Hole; Number of Pins: 10P; Number of Rows: 1; Number of PINs Per Row: 10; Screw Specification: M2.5; Current Rating: 15A; Voltage Rating (Max): 300V; Wire Gauge - AWG: 12~24; Operating Temperature: -40℃~+105℃
U34 = JL301-50002U04: Number of Positions or Pins:1x2P Pitch:5mm Color:Blue Mounting Type:Through Hole Number of Pins:2P Number of Rows:1 Number of PINs Per Row:2 Screw Specification:M2.5 Current Rating:15A Voltage Rating (Max):300V Wire Gauge - AWG:12~24 Operating Temperature; LCSC Part Name: 1x2P 5mm 直插 排数:1 每排P数:2; Supplier Part: C1509679; Manufacturer: JILN(锦凌); Supplier Footprint: 插件,P=5mm; JLCPCB Part Class: Extended Part; Datasheet: https://item.szlcsc.com/datasheet/JL301-50002U04/1600353.html; Supplier: LCSC; Number of Positions or Pins: 1x2P; Pitch: 5mm; Color: Blue; Mounting Type: Through Hole; Number of Pins: 2P; Number of Rows: 1; Number of PINs Per Row: 2; Screw Specification: M2.5; Current Rating: 15A; Voltage Rating (Max): 300V; Wire Gauge - AWG: 12~24; Operating Temperature: -40℃~+105℃
U35 U36 = JL301-50004U02: Number of Positions or Pins:1x4P Pitch:5mm Color:Blue Mounting Type:Through Hole Number of Pins:4P Number of Rows:1 Screw Specification:M2.5 Current Rating:15A Voltage Rating (Max):300V Wire Gauge - AWG:12~24; LCSC Part Name: 1x4P 5mm 直插 排数:1; Supplier Part: C409137; Manufacturer: JILN(锦凌); Supplier Footprint: 插件,P=5mm; JLCPCB Part Class: Extended Part; Datasheet: https://item.szlcsc.com/datasheet/JL301-50004U02/399067.html; Supplier: LCSC; Number of Positions or Pins: 1x4P; Pitch: 5mm; Color: Blue; Mounting Type: Through Hole; Number of Pins: 4P; Number of Rows: 1; Screw Specification: M2.5; Current Rating: 15A; Voltage Rating (Max): 300V; Wire Gauge - AWG: 12~24
U39 = INA180A2IDBVR: Number of Channels:1 Vcm - Common Mode Voltage:-200mV~26V Vcm - Common Mode Voltage:-200mV~26V Gain:50V/V Bandwidth:210kHz Ib - Input Bias Current:100nA Vos - Input Offset Voltage:25uV Operating Temperature:-40℃~+125℃ Operating Temperature:-40℃~+125℃ Diff; Supplier Part: C192764; Manufacturer: TI(德州仪器); Supplier Footprint: SOT-23-5; JLCPCB Part Class: Extended Part; Datasheet: https://www.ti.com/cn/lit/gpn/ina180; Supplier: LCSC; Number of Channels: 1; Vcm - Common Mode Voltage: -200mV~26V; Gain: 50V/V; Bandwidth: 210kHz; Ib - Input Bias Current: 100nA; Vos - Input Offset Voltage: 25uV; Operating Temperature: -40℃~+125℃; Differential Voltage: -26V~+26V; Single Supply: 2.7V~5.5V; Quiescent Current: 197uA; Output Current: 8mA; Input Offset Voltage Drift(Vos TC): 1uV/℃; Input Offset Current(Ios): 50nA; Slew Rate: 2V/us; Common Mode Rejection Ratio (CMRR): 100dB; Noise density(eN): 40nV/√Hz

## Nets
1.1V: C27.2 C28.2 C30.2 C31.2 L3.2 U1.10(DVDD) U1.32(DVDD) U1.51(DVDD) U1.65(VREG_FB)
1.8V: 1.8V.1 C40.2 U16.1
3.3V: 3.3V.1 C1.2 C2.2 C22.2 C23.2 C24.2 C25.2 C26.2 C29.2 C35.1 C36.2 C41.1 C42.2 C43.1 C44.2 D5.2(A) R14.1 R18.2 R21.2 SW5.1 SW6.1 TF2.4(VDD) U1.5(IOVDD) U1.15(IOVDD) U1.24(IOVDD) U1.29(IOVDD) U1.41(IOVDD) U1.50(IOVDD) U1.60(IOVDD) U1.64(VREG_VIN) U1.69(QSPI_IOVDD) U1.76(IOVDD) U3.B3(VDDIO) U4.5(VDDIO) U4.8(VDD) U5.1(VDDIO) U5.10(VDD) U7.8(VCC) U17.1 U19.2 U32.5
5V: U31.1(VDD) U39.5(VS) U40.1(VDD) U41.1(VDD) U42.1(VDD)
+5V: 5V.1 D1.1(C) D2.1(C) U18.2 U24.1 U25.1 U32.3 U33.8 U37.2 U37.5 U37.8 U37.11 U38.2 U38.5 U38.8 U38.11
GND: C1.1 C2.1 C20.2 C21.2 C22.1 C23.1 C24.1 C25.1 C26.1 C27.1 C28.1 C29.1 C30.1 C31.1 C32.2 C33.1 C34.1 C35.2 C36.1 C37.2 C39.2 C41.2 C42.1 C43.2 C44.1 C45.2 C46.1 GND.1 LED4.2(K) LED5.2(K) LED6.2(K) Q1.2(S) Q2.2(S) R12.2 R13.2 R20.1 SW5.2 SW6.2 TF2.6(VSS) TF2.10(GND) TF2.11(GND) TF2.12(GND) TF2.13(GND) U1.62(VREG_PGND) U1.81(GND) U3.B1(GND) U3.B2(ADSEL) U3.C3(BYPASS) U4.6(GNDIO) U4.7(GND) U5.3(VSS) U5.8(VSS) U5.9(VSS) U6.2(GND) U6.4(GND) U7.4(GND) U13.3(GND) U13.8(GND) U13.9(GND) U13.10(GND) U13.13(GND) U13.14(GND) U13.15(GND) U13.16(GND) U13.17(GND) U13.18(GND) U13.19(GND) U13.20(GND) U13.21(GND) U13.22(GND) U13.23(GND) U14.2(GND) U14.3(EN) U15.2(GND) U15.3(EN) U31.3(VSS) U32.4 U33.7 U34.1 U37.1 U37.4 U37.7 U37.10 U38.1 U38.4 U38.7 U38.10 U39.2(GND) U40.3(VSS) U41.3(VSS) U42.3(VSS) USB1.1(GND) USB1.12(GND)
VCC: 12V.1 C20.1 C21.1 C47.1 C47.2 U13.1(Vin) U13.2(Vin) U32.2 U33.9 U34.2 U39.3(IN+) U39.4(IN-)
ADC0: R24.1 U1.49(GPIO40_ADC0)
ADC1: R25.1 U1.52(GPIO41_ADC1)
ADC2: U1.53(GPIO42_ADC2) U39.1(OUT)
CLK: TF2.5(CLK) U1.13(GPIO14) U32.7
CS: U1.9(GPIO11) U32.9
GPIO0: R23.1 U1.77(GPIO0)
GPIO1: R22.1 U1.78(GPIO1)
GPIO13: U1.12(GPIO13) U5.6(CSB)
GPIO16: U1.16(GPIO16) U4.1(SDO) U5.5(SDO)
GPIO17: U1.17(GPIO17) U4.12(CSB)
GPIO18: U1.18(GPIO18) U4.13(SCX) U5.2(SCK)
GPIO19: U1.19(GPIO19) U4.14(SDX) U5.4(SDI)
GPIO20: U1.20(GPIO20) U4.4(INT1)
GPIO21: U5.7(INT)
MISO: TF2.7(DAT0) U1.11(GPIO12) U32.6
MOSI: TF2.3(CMD) U1.14(GPIO15) U32.8
NEOIN: U1.80(GPIO3) U40.4(DIN)
NET1: U33.1
NET2: U33.2
NET5: U32.10
NET15: U37.3
NET16: U37.6
NET17: U37.9
NET18: U37.12
NET19: U38.3
NET20: U38.6
NET21: U38.9
NET22: U38.12
PISTA: U1.79(GPIO2) U31.4(DIN)
QSPI_SCLK: U1.71(QSPI_SCLK) U7.6(CLK)
QSPI_SD1: U1.74(QSPI_SD1) U7.2(DO)
QSPI_SD2: U1.73(QSPI_SD2) U7.3(IO2)
QSPI_SD3: U1.70(QSPI_SD3) U7.7(IO3)
QSPI_SDO: U1.72(QSPI_SD0) U7.5(DI)
QSPI_SS: R16.2 R18.1 U1.75(QSPI_SS) U7.1(CS#)
RPD+: R4.1 USB1.6(DP1) USB1.8(DP2)
RPD-: R3.1 USB1.5(DN2) USB1.7(DN1)
RX: U33.3
SCL: U33.5
SDA: U33.6
SDCS: TF2.2(CD/DAT3) U1.2(GPIO5)
TX: U33.4
XIN: C33.2 U1.30(XIN) U6.3
XOUT: R17.1 U1.31(XOUT)
$3N500: U15.5(VOUT) U16.2
$3N502: U14.5(VOUT) U17.2
$3N981: U14.4(VIN) U18.1
$3N1023: U15.1(VIN) U19.1
$3N2385: C38.1 U13.7(Vout) U24.2
$3N2422: C37.1 U13.5(Sense) U13.6(Vout) U25.2
$3N3774: R19.2 U13.4(Trim)
$3N3813: R19.1 R20.2
$3N4055: R21.1 U13.11(PWGOOD)
$3N4153: C39.1 U3.C2(CRST)
$3N4271: C40.1 C46.2 U3.C1(VDD)
$3N4404: R22.2 U3.A3(SCK)
$3N4443: R23.2 U3.A2(SDA)
$3N5055: C45.1 U3.A1(INT)
$3N10357: Q1.1(G) R24.2
$3N13570: Q2.3(D) U33.10
$3N13572: Q2.1(G) R25.2
$3N13582: Q1.3(D) U32.1
$5N665: D1.2(A) USB1.2(VBUS)
$5N667: D2.2(A) USB1.11(VBUS)
$5N714: R3.2 U1.66(USB_DM)
$5N753: R4.2 U1.67(USB_DP)
$5N865: R12.1 USB1.4(CC1)
$5N907: R13.1 USB1.10(CC2)
$5N1500: L3.1 U1.63(VREG_LX)
$5N1577: C32.1 R14.2 U1.61(VREG_AVDD)
$5N3555: R15.2 U1.35(RUN)
$5N4153: D4.1(K) LED4.1(A)
$5N4199: D3.1(K) LED5.1(A)
$5N4367: D5.1(K) LED6.1(A)
$5N4916: C34.2 R17.2 U6.1
$5N10092: R16.1 SW5.3
$5N10100: D3.2(A) SW5.4
$5N12881: R15.1 SW6.3
$5N12933: D4.2(A) SW6.4
$5N18524: U40.2(DOUT) U41.4(DIN)
$5N18586: U41.2(DOUT) U42.4(DIN)

Not connected (* = marked no-connect by the designer): C38 2; TF2 1(DAT2) 8(DAT1) 9(CD); U1 1(GPIO4) 3(GPIO6) 4(GPIO7) 6(GPIO8) 7(GPIO9) 8(GPIO10) 21(GPIO21) 22(GPIO22) 23(GPIO23) 25(GPIO24) 26(GPIO25) 27(GPIO26) 28(GPIO27) 33(SWCLK) 34(SWDIO) 36(GPIO28) 37(GPIO29) 38(GPIO30) 39(GPIO31) 40(GPIO32) 42(GPIO33) 43(GPIO34) 44(GPIO35) 45(GPIO36) 46(GPIO37) 47(GPIO38) 48(GPIO39) 54(GPIO43_ADC3) 55(GPIO44_ADC4) 56(GPIO45_ADC5) 57(GPIO46_ADC6) 58(GPIO47_ADC7) 59(ADC_AVDD) 68(USB_OTP_VDD); U4 2(ASDX) 3(ASCX) 9(INT2) 10(OCSB) 11(OSDO); U13 12(ON/OFF); U14 1(NC); U15 4(NC); U31 2(DOUT); U35 1 2 3 4; U36 1 2 3 4; U42 2(DOUT); USB1 3(SBU2) 9(SBU1) 13(SHELL) 14(SHELL)

# Board PCB1
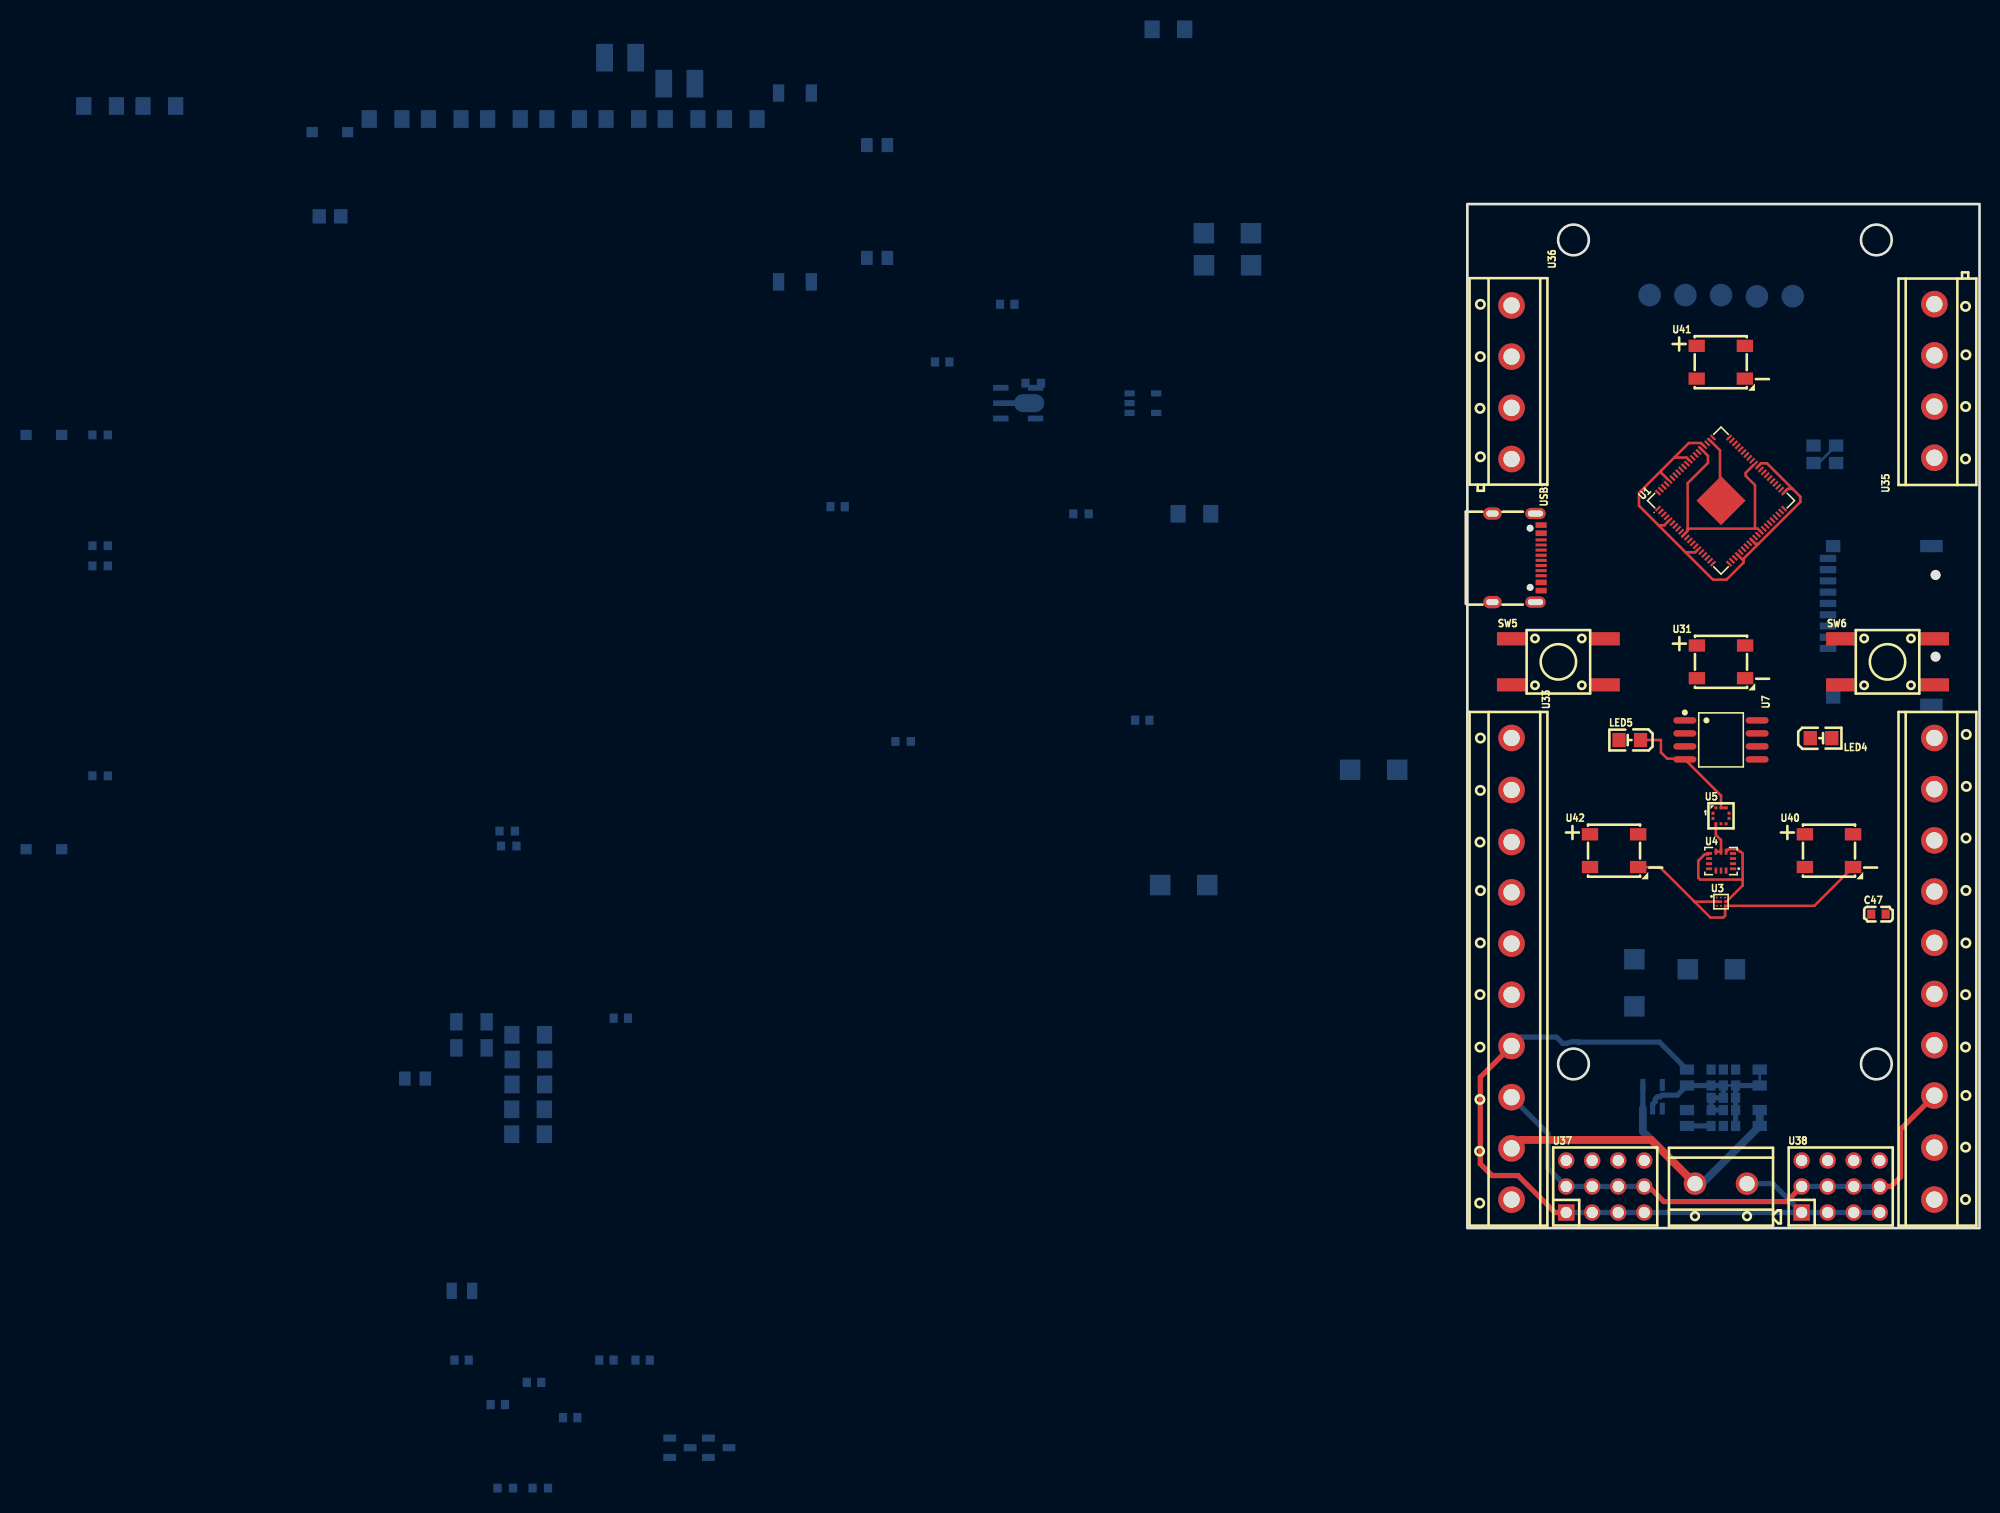
[diagram p2: board, top side]
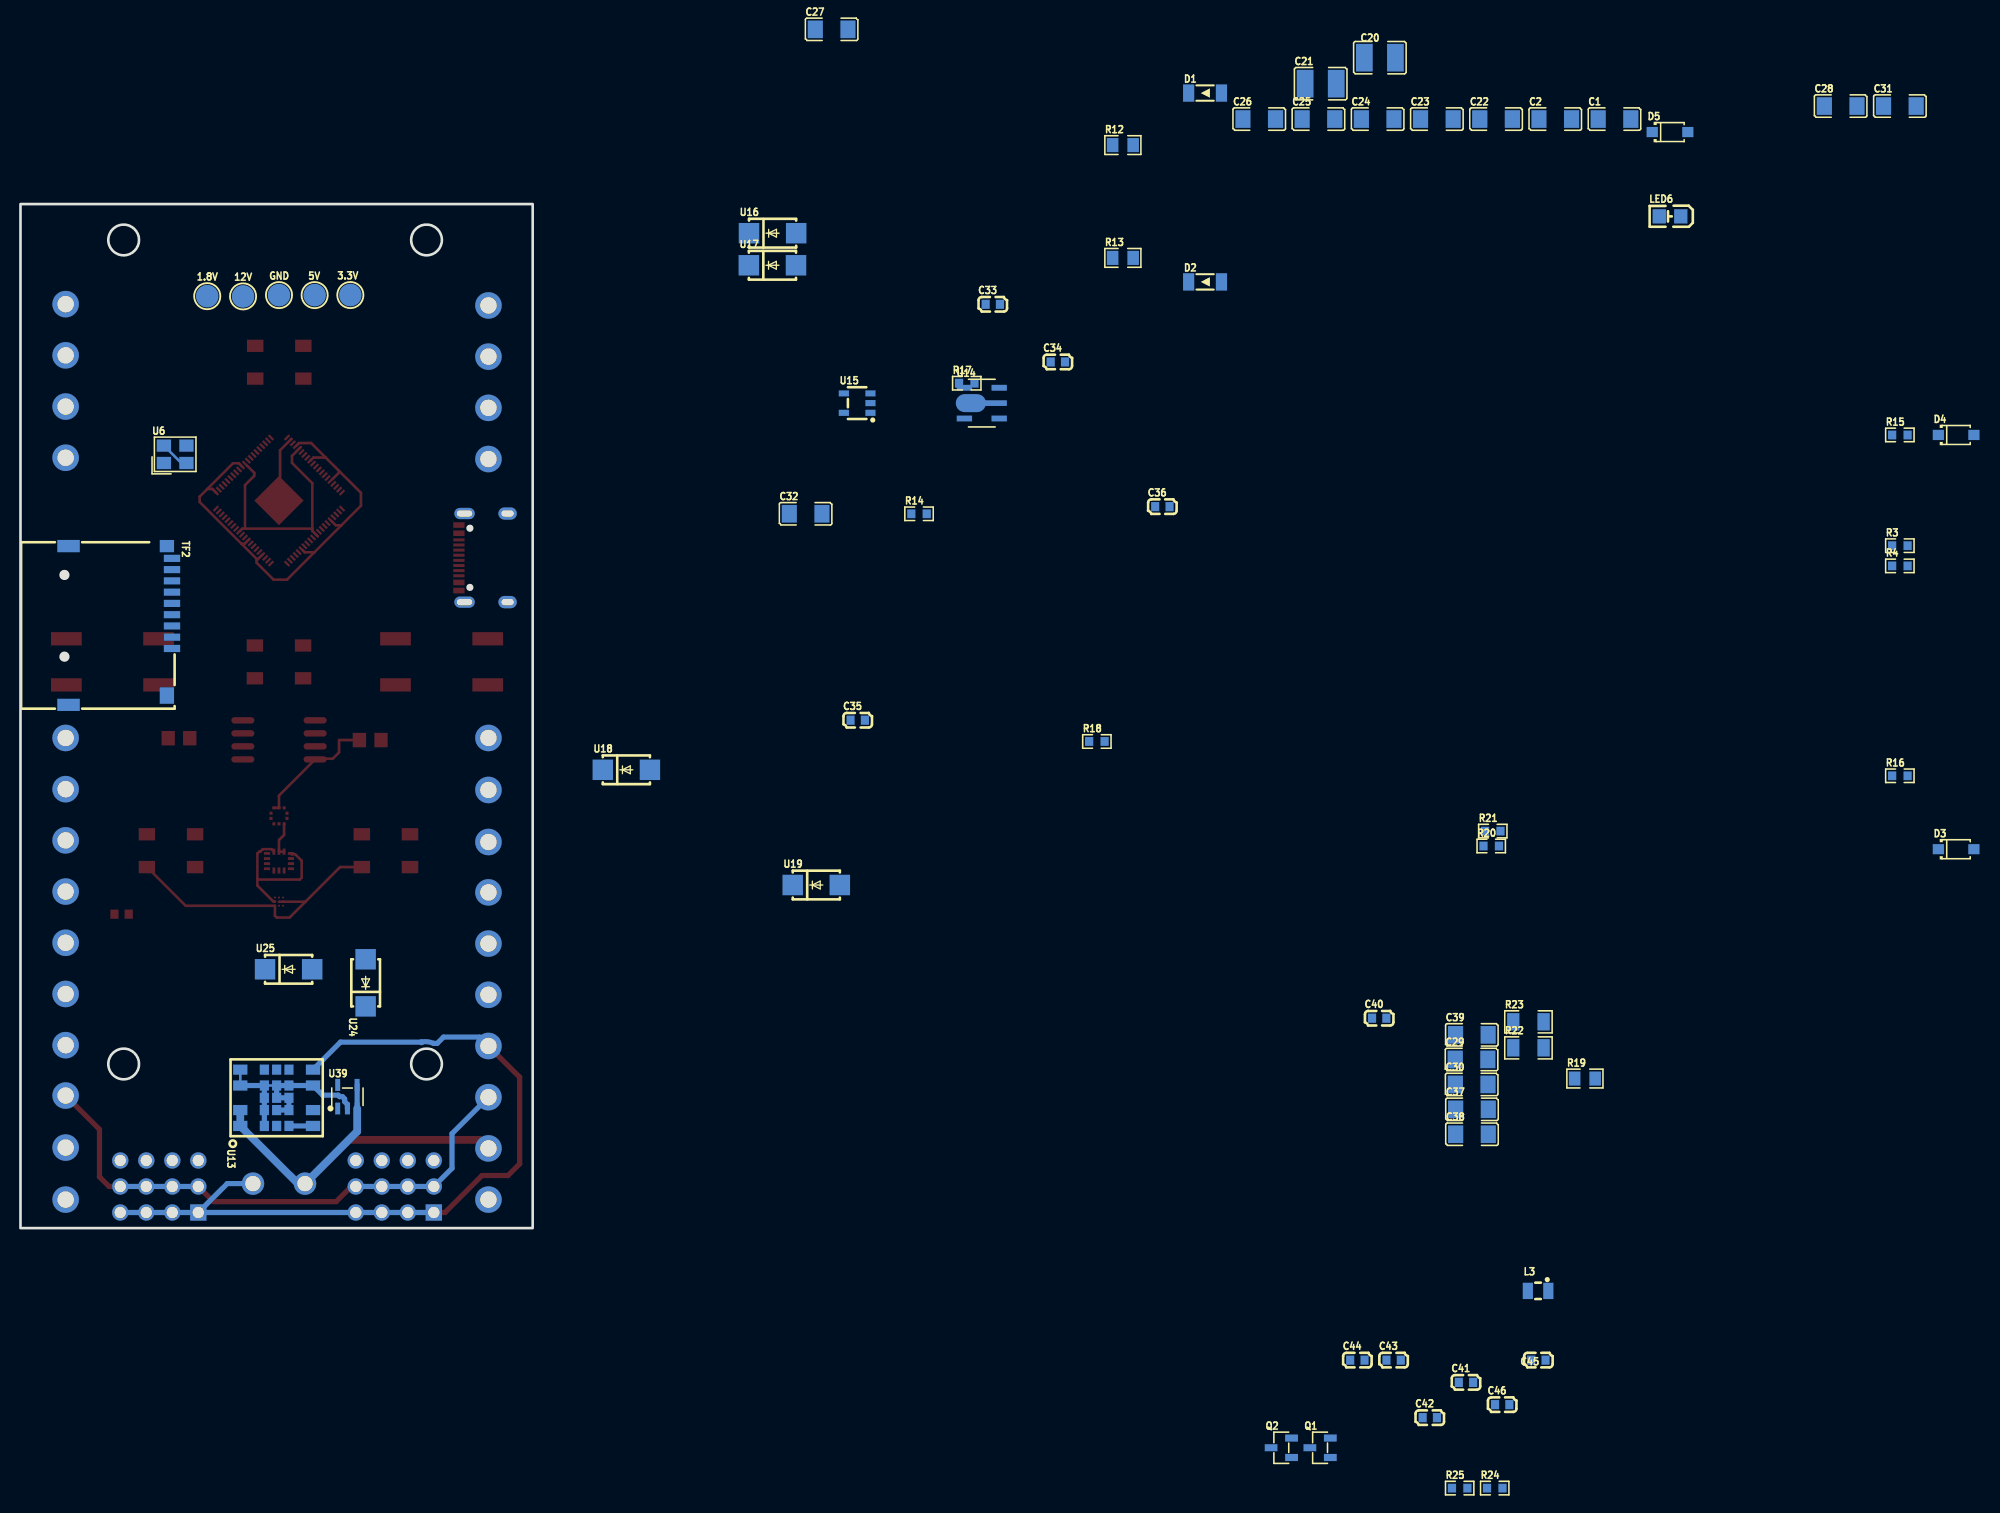
[diagram p3: board, bottom side, seen from below]

Outline 50 x 100 mm; copper layers: Top Layer, Inner1, Inner2, Bottom Layer. Coordinates in mm from the lower left corner of the outline.
Outline path: rectangle 0,100 50,0 ; circle c10.36,96.5 r1.5 ; circle c10.36,16.03 r1.5 ; circle c39.93,96.5 r1.5 ; circle c39.93,16.03 r1.5
Stack: Top Layer 0.035mm Outer layer thickness 1oz / Dielectric1 0.2104mm 7628 RC49% 8.6mil / Inner1 0.0152mm Inner layer thickness / Dielectric2 1.065mm 1.1mm H/HOZ Copper / Inner2 0.0152mm Inner layer thickness / Dielectric3 0.2104mm 7628 RC49% 8.6mil / Bottom Layer 0.035mm Outer layer thickness 1oz

## Design rules (mm)
template: JLCPCB Capability(Two Layers Board)
spacing copperThickness1oz (default): track to track 0.102, other pairs 0.152 to 0.3
spacing copperThickness2oz: track to track 0.203, other pairs 0.152 to 0.3
track width copperThickness1oz (default): min 0.127, default 0.254, max 2.54
track width copperThickness2oz: min 0.203, default 0.254, max 2.54
differential pair differentialPair (default): width min 0.127, default 0.254, max 2.54; gap min 0.152, default 0.152
via viaSize (default): diameter min 0.5, default 0.61, max 10; hole min 0.3, default 0.305, max 6.3

## Placement (name value [footprint] x y rotation side)
1.8V  90645-AS  [SMD_BD1.8-H8.0]  31.77 91.01 180 bottom
3.3V  90645-AS  [SMD_BD1.8-H8.0]  17.8 91.11 180 bottom
5V  90645-AS  [SMD_BD1.8-H8.0]  21.28 91.11 180 bottom
12V  90645-AS  [SMD_BD1.8-H8.0]  28.27 90.98 180 bottom
C1  100uF  [C1206]  -105.6 108.3 180 bottom
C2  100uF  [C1206]  -99.82 108.3 180 bottom
C20  22uF  [C1210]  -82.7 114.3 180 bottom
C21  22uF  [C1210]  -76.92 111.76 180 bottom
C22  100uF  [C1206]  -94.05 108.3 180 bottom
C23  100uF  [C1206]  -88.27 108.3 180 bottom
C24  100uF  [C1206]  -82.49 108.3 180 bottom
C25  100uF  [C1206]  -76.71 108.3 180 bottom
C26  100uF  [C1206]  -70.93 108.3 180 bottom
C27  100uF  [C1206]  -29.18 117.06 180 bottom
C28  100uF  [C1206]  -127.68 109.57 180 bottom
C29  4.7uF  [C1206]  -91.65 16.47 180 bottom
C30  4.7uF  [C1206]  -91.66 14.03 180 bottom
C31  4.7uF  [C1206]  -133.46 109.57 180 bottom
C32  4.7uF  [C1206]  -26.64 69.75 180 bottom
C33  15pF  [C0603]  -44.92 90.21 180 bottom
C34  15pF  [C0603]  -51.27 84.58 180 bottom
C35  100nF  [C0603]  -31.73 49.6 180 bottom
C36  100nF  [C0603]  -61.47 70.45 180 bottom
C37  100uF  [C1206]  -91.69 11.6 180 bottom
C38  100uF  [C1206]  -91.69 9.17 180 bottom
C39  2.2uF  [C1206]  -91.68 18.87 180 bottom
C40  10nF  [C0603]  -82.64 20.5 180 bottom
C41  100nF  [C0603]  -91.11 -15.07 180 bottom
C42  100nF  [C0603]  -87.58 -18.51 180 bottom
C43  100nF  [C0603]  -84.04 -12.89 180 bottom
C44  100nF  [C0603]  -80.51 -12.89 180 bottom
C45  100nF  [C0603]  -98.18 -12.89 180 bottom
C46  100nF  [C0603]  -94.64 -17.24 180 bottom
C47  100nF  [C0603]  40.13 30.66 0 top
D1  5.6V稳压管  [LL-34_L3.5-W1.5-RD]  -65.64 110.84 180 bottom
D2  5.6V稳压管  [LL-34_L3.5-W1.5-RD]  -65.64 92.4 180 bottom
D3  1N4148W  [SOD-123F_L2.7-W1.6-LS3.8-RD]  -138.95 37 180 bottom
D4  1N4148W  [SOD-123F_L2.7-W1.6-LS3.8-RD]  -138.95 77.45 180 bottom
D5  1N4148W  [SOD-123F_L2.7-W1.6-LS3.8-RD]  -111.03 107.03 180 bottom
GND  90645-AS  [SMD_BD1.8-H8.0]  24.76 91.11 180 bottom
L3  3.3uH  [IND-SMD_L2.0-W1.6_AOTA-B201610S3R3-101-T]  -98.14 -6.13 180 bottom
LED4  YLED0805G  [LED0805-FD-GREEN]  34.53 47.84 180 top
LED5  YLED0805G  [LED0805-FD-GREEN]  15.86 47.66 0 top
LED6  YLED0805G  [LED0805-FD-GREEN]  -111.03 98.8 180 bottom
Q1  AO3400A  [SOT-23-3_L2.9-W1.3-P1.90-LS2.4-BR]  -76.87 -21.45 180 bottom
Q2  AO3400A  [SOT-23-3_L2.9-W1.3-P1.90-LS2.4-BR]  -73.08 -21.45 180 bottom
R3  261kΩ  [R0603]  -133.46 66.64 180 bottom
R4  261kΩ  [R0603]  -133.46 64.67 180 bottom
R12  5.1kΩ  [R0805]  -57.62 105.76 180 bottom
R13  5.1kΩ  [R0805]  -57.62 94.74 180 bottom
R14  33Ω  [R0603]  -37.71 69.75 180 bottom
R15  1kΩ  [R0603]  -133.46 77.45 180 bottom
R16  1kΩ  [R0603]  -133.46 44.17 180 bottom
R17  1kΩ  [R0603]  -42.38 82.51 180 bottom
R18  10kΩ  [R0603]  -55.08 47.52 180 bottom
R19  1.2kΩ  [R0805]  -102.72 14.6 180 bottom
R20  160kΩ  [R0603]  -93.57 37.31 180 bottom
R21  10kΩ  [R0603]  -93.72 38.77 180 bottom
R22  4.7kΩ  [R1206]  -97.21 17.6 180 bottom
R23  4.7kΩ  [R1206]  -97.21 20.14 180 bottom
R24  10kΩ  [R0603]  -93.91 -25.39 180 bottom
R25  10kΩ  [R0603]  -90.49 -25.39 180 bottom
SW5  KSC441G70SHLFS  [KEY--SMD_4P-L6.2-W6.2-P4.50-LS12.0]  8.89 55.3 0 top
SW6  KSC441G70SHLFS  [KEY--SMD_4P-L6.2-W6.2-P4.50-LS12.0]  41.02 55.3 0 top
TF2  TF-CARD H1.8  [TF-SMD_TF-CARD-H1.8]  40.26 58.85 270 bottom
U1  RP2350B  [QFN-80_L10.0-W10.0-P0.40-TL-EP3.4]  24.76 71.04 45 top
U3  BMM350  [WLCSP-9_L1.3-W1.3-R3-C3-P0.40-TL]  24.76 31.88 0 top
U4  BMI270  [LGA-14_L3.0-W2.5-P0.50-BR]  24.76 35.84 0 top
U5  BMP581  [LGA-10_L2.0-W2.0-P0.50-TL_BMP581]  24.76 40.26 0 top
U6  ABM8-272-T3  [CRYSTAL-SMD_4P-L3.2-W2.5-BL]  34.9 75.56 180 bottom
U7  W25Q128JVSIQ  [SOIC-8_L5.3-W5.3-P1.27-LS8.0-BL]  24.76 47.68 270 top
U13  MYMGK00506ERSR  [LGA-23_L9.0-W7.5_MYMGK00506ERSR]  24.99 12.73 90 bottom
U14  AP2112R5A-1.8TRG1  [SOT-89-5_L4.5-W2.5-P1.50-LS4.5-BR]  -43.84 80.56 180 bottom
U15  AP2112K-3.3TRG1(MS)  [SOT-23-5_L2.9-W1.6-P0.95-LS2.7-BR]  -31.67 80.56 180 bottom
U16  CDBA140SL-HF  [DO-214AC_L4.3-W2.7-LS5.3-RD]  -23.42 97.16 180 bottom
U17  CDBA140SL-HF  [DO-214AC_L4.3-W2.7-LS5.3-RD]  -23.4 94.02 180 bottom
U18  CDBA140SL-HF  [DO-214AC_L4.3-W2.7-LS5.3-RD]  -9.14 44.75 180 bottom
U19  CDBA140SL-HF  [DO-214AC_L4.3-W2.7-LS5.3-RD]  -27.69 33.5 180 bottom
U24  CDBA140SL-HF  [DO-214AC_L4.3-W2.7-LS5.3-RD]  16.31 23.95 90 bottom
U25  CDBA140SL-HF  [DO-214AC_L4.3-W2.7-LS5.3-RD]  23.82 25.27 180 bottom
U31  WS2812  [LED-SMD_4P-L5.0-W5.0-TL-A]  24.76 55.3 0 top
U32  JL301-50010U02  [CONN-TH_10P-P5.00_JL301-50010U02]  45.59 25.32 90 top
U33  JL301-50010U02  [CONN-TH_10P-P5.00_JL301-50010U02]  4.32 25.32 270 top
U34  JL301-50002U04  [CONN-TH_JL301-50002U01]  24.76 4.34 180 top
U35  JL301-50004U02  [CONN-TH_4P-P5.00_JL301-50004U02]  45.59 82.73 90 top
U36  JL301-50004U02  [CONN-TH_4P-P5.00_JL301-50004U02]  4.32 82.6 270 top
U37  HX PZ2.54-3x4P ZZ  [HDR-TH_12P-P2.54-V-M-R3-C4-S2.54]  13.46 4.06 0 top
U38  HX PZ2.54-3x4P ZZ  [HDR-TH_12P-P2.54-V-M-R3-C4-S2.54]  36.45 4.06 0 top
U39  INA180A2IDBVR  [SOT-23-5_L3.0-W1.7-P0.95-LS2.8-BL]  18.09 12.83 180 bottom
U40  WS2812  [LED-SMD_4P-L5.0-W5.0-TL-A]  35.31 36.86 0 top
U41  WS2812  [LED-SMD_4P-L5.0-W5.0-TL-A]  24.74 84.56 0 top
U42  WS2812  [LED-SMD_4P-L5.0-W5.0-TL-A]  14.33 36.86 0 top
USB1  TYPE-C 16PIN 2MD(073)  [USB-C-SMD_TYPE-C-6PIN-2MD-073]  4.83 65.46 270 top

## Footprints (pads in the part's own frame, mm; a bottom-side part is the same pattern mirrored in y, then rotated)
C0603
  rect 0.8x0.9 smd: 1(-0.7,0) 2(0.7,0)
C1206
  rect 1.485x1.728 smd: 1(-1.593,0) 2(1.593,0)
C1210
  rect 1.635x2.7 smd: 1(-1.518,0) 2(1.518,0)
CONN-TH_4P-P5.00_JL301-50004U02
  round 2.6 hole 1.6: 1(-7.5,0) 2(-2.5,0) 3(2.5,0) 4(7.5,0)
CONN-TH_10P-P5.00_JL301-50010U02
  round 2.6 hole 1.6: 1(-22.54,0) 2(-17.46,0) 3(-12.38,0) 4(-7.46,0) 5(-2.46,0) 6(2.54,0) 7(7.54,0) 8(12.54,0) 9(17.54,0) 10(22.54,0)
CONN-TH_JL301-50002U01
  round 2.2 hole 1.5: 1(-2.54,0) 2(2.54,0)
CRYSTAL-SMD_4P-L3.2-W2.5-BL
  rect 1.4x1.2 smd: 1(-1.1,-0.85) 2(1.1,-0.85) 3(1.1,0.85) 4(-1.1,0.85)
DO-214AC_L4.3-W2.7-LS5.3-RD
  rect 2x2 smd: 1(-2.3,0) 2(2.3,0)
HDR-TH_12P-P2.54-V-M-R3-C4-S2.54
  rect 1.6x1.6 hole 1.1: 1(-3.81,-2.54)
  round 1.6 hole 1.1: 2(-3.81,0) 3(-3.81,2.54) 4(-1.27,-2.54) 5(-1.27,0) 6(-1.27,2.54) 7(1.27,-2.54) 8(1.27,0) 9(1.27,2.54) 10(3.81,-2.54) 11(3.81,0) 12(3.81,2.54)
IND-SMD_L2.0-W1.6_AOTA-B201610S3R3-101-T
  rect 1x1.6 smd: 1(-1,0) 2(1,0)
KEY--SMD_4P-L6.2-W6.2-P4.50-LS12.0
  rect 3x1.3 smd: 1(-4.5,2.25) 2(4.5,2.25) 3(-4.5,-2.25) 4(4.5,-2.25)
LED0805-FD-GREEN
  rect 1.3x1.399 smd: 1(-1.05,0) 2(1.05,0)
LED-SMD_4P-L5.0-W5.0-TL-A
  rect 1.6x1.2 smd: 1(-2.35,1.6) 2(-2.35,-1.6) 3(2.35,-1.6) 4(2.35,1.6)
LGA-10_L2.0-W2.0-P0.50-TL_BMP581
  rect 0.3x0.3 smd: 1(-0.78,0.25) 2(-0.78,-0.25) 3(-0.5,-0.78) 4(0,-0.78) 5(0.5,-0.78) 6(0.78,-0.25) 7(0.78,0.25) 8(0.5,0.78) 9(0,0.78) 10(-0.5,0.78)
LGA-14_L3.0-W2.5-P0.50-BR
  rect 0.6x0.27 smd: 1(1.17,-0.75) 2(1.17,-0.25) 3(1.17,0.25) 4(1.17,0.75) 8(-1.17,0.75) 9(-1.17,0.25) 10(-1.17,-0.25) 11(-1.17,-0.75)
  rect 0.27x0.6 smd: 5(0.5,0.92) 6(0,0.92) 7(-0.5,0.92) 12(-0.5,-0.92) 13(0,-0.92) 14(0.5,-0.92)
LGA-23_L9.0-W7.5_MYMGK00506ERSR
  rect 1x1.4 smd: 1(-2.75,3.55) 2(-1.2,3.55) 6(-2.75,-3.55) 7(-1.2,-3.55) 8(1.2,-3.55) 9(2.75,-3.55) 13(2.75,3.55) 14(1.2,3.55)
  rect 1x0.9 smd: 3(-2.75,1.2) 4(-2.75,0) 5(-2.75,-1.2) 10(2.75,-1.2) 11(2.75,0) 12(2.75,1.2) 15(-1.2,1.2) 16(-1.2,0) 17(-1.2,-1.2) 18(0,1.2) 19(0,0) 20(0,-1.2) 21(1.2,1.2) 22(1.2,0) 23(1.2,-1.2)
LL-34_L3.5-W1.5-RD
  rect 1.1x1.7 smd: 1(-1.6,0) 2(1.6,0)
QFN-80_L10.0-W10.0-P0.40-TL-EP3.4
  rect 0.665x0.22 smd: 1(-4.907,3.8) 2(-4.907,3.4) 3(-4.907,3) 4(-4.907,2.6) 5(-4.907,2.2) 6(-4.907,1.8) 7(-4.907,1.4) 8(-4.907,1) 9(-4.907,0.6) 10(-4.907,0.2) 11(-4.907,-0.2) 12(-4.907,-0.6) 13(-4.907,-1) 14(-4.907,-1.4) 15(-4.907,-1.8) 16(-4.907,-2.2) 17(-4.907,-2.6) 18(-4.907,-3) 19(-4.907,-3.4) 20(-4.907,-3.8) 41(4.907,-3.8) 42(4.907,-3.4) 43(4.907,-3) 44(4.907,-2.6) 45(4.907,-2.2) 46(4.907,-1.8) 47(4.907,-1.4) 48(4.907,-1) 49(4.907,-0.6) 50(4.907,-0.2) 51(4.907,0.2) 52(4.907,0.6) 53(4.907,1) 54(4.907,1.4) 55(4.907,1.8) 56(4.907,2.2) 57(4.907,2.6) 58(4.907,3) 59(4.907,3.4) 60(4.907,3.8)
  rect 0.22x0.665 smd: 21(-3.8,-4.907) 22(-3.4,-4.907) 23(-3,-4.907) 24(-2.6,-4.907) 25(-2.2,-4.907) 26(-1.8,-4.907) 27(-1.4,-4.907) 28(-1,-4.907) 29(-0.6,-4.907) 30(-0.2,-4.907) 31(0.2,-4.907) 32(0.6,-4.907) 33(1,-4.907) 34(1.4,-4.907) 35(1.8,-4.907) 36(2.2,-4.907) 37(2.6,-4.907) 38(3,-4.907) 39(3.4,-4.907) 40(3.8,-4.907) 61(3.8,4.907) 62(3.4,4.907) 63(3,4.907) 64(2.6,4.907) 65(2.2,4.907) 66(1.8,4.907) 67(1.4,4.907) 68(1,4.907) 69(0.6,4.907) 70(0.2,4.907) 71(-0.2,4.907) 72(-0.6,4.907) 73(-1,4.907) 74(-1.4,4.907) 75(-1.8,4.907) 76(-2.2,4.907) 77(-2.6,4.907) 78(-3,4.907) 79(-3.4,4.907) 80(-3.8,4.907)
  rect 3.4x3.4 smd: 81(0,0)
R0603
  rect 0.806x0.864 smd: 1(-0.753,0) 2(0.753,0)
R0805
  rect 1.133x1.377 smd: 1(-1,0) 2(1,0)
R1206
  rect 1.208x1.701 smd: 1(-1.479,0) 2(1.479,0)
SMD_BD1.8-H8.0
  custom 2.2x2.21 smd: 1(0,0)
SOD-123F_L2.7-W1.6-LS3.8-RD
  rect 1.1x1 smd: 1(-1.735,0) 2(1.735,0)
SOIC-8_L5.3-W5.3-P1.27-LS8.0-BL
  oval 0.63x2.25 smd: 1(-1.905,-3.53) 2(-0.635,-3.53) 3(0.635,-3.53) 4(1.905,-3.53) 5(1.905,3.53) 6(0.635,3.53) 7(-0.635,3.53) 8(-1.905,3.53)
SOT-23-3_L2.9-W1.3-P1.90-LS2.4-BR
  rect 1.25x0.7 smd: 1(1,-0.95) 2(1,0.95) 3(-1,0)
SOT-23-5_L2.9-W1.6-P0.95-LS2.7-BR
  rect 1x0.6 smd: 1(1.3,-0.95) 2(1.3,0) 3(1.3,0.95) 4(-1.3,0.95) 5(-1.3,-0.95)
SOT-23-5_L3.0-W1.7-P0.95-LS2.8-BL
  rect 0.49x1.157 smd: 1(-0.95,-1.153) 2(0,-1.153) 3(0.95,-1.153)
  rect 0.49x1.175 smd: 4(0.95,1.153) 5(-0.95,1.153)
SOT-89-5_L4.5-W2.5-P1.50-LS4.5-BR
  rect 1.5x0.574 smd: 1(1.698,-1.5) 3(1.698,1.5) 4(-1.698,1.5) 5(-1.698,-1.5)
  oval 2.94x1.76 smd: 2(-1.067,0)
  rect 2.209x0.552 smd: 2(1.343,0)
TF-SMD_TF-CARD-H1.8
  rect 0.7x1.6 smd: 1(2.25,5.05) 2(1.15,5.05) 3(0.05,5.05) 4(-1.05,5.05) 5(-2.15,5.05) 6(-3.25,5.05) 7(-4.35,5.05) 8(-5.45,5.05) 9(-6.55,5.05)
  rect 1.2x1.4 smd: 10(-7.747,4.55)
  rect 1.2x2.2 smd: 11(-7.75,-5.05) 12(7.75,-5.05)
  rect 1.6x1.4 smd: 13(6.85,4.55)
USB-C-SMD_TYPE-C-6PIN-2MD-073
  rect 0.55x1.1 smd: 1(-3.2,2.375) 2(-2.4,2.375) 11(2.4,2.375) 12(3.2,2.375)
  rect 0.3x1.1 smd: 3(-1.75,2.375) 4(-1.25,2.375) 5(-0.75,2.375) 6(-0.25,2.375) 7(0.25,2.375) 8(0.75,2.375) 9(1.25,2.375) 10(1.75,2.375)
  oval 1.1x2 hole 0.6x1.5: 13(-4.325,1.825) 14(4.325,1.825)
  oval 1.2x1.8 hole 0.6x1.2: 13(-4.325,-2.375) 14(4.325,-2.375)
WLCSP-9_L1.3-W1.3-R3-C3-P0.40-TL
  round 0.2 smd: A1(-0.4,0.4) A2(0,0.4) A3(0.4,0.4) B1(-0.4,0) B2(0,0) B3(0.4,0) C1(-0.4,-0.4) C2(0,-0.4) C3(0.4,-0.4)

## Nets
As in the schematic.

Pads without a net: C38 2; TF2 1 8 9; U1 1 3 4 6 7 8 21 22 23 25 26 27 28 33 34 36 37 38 39 40 42 43 44 45 46 47 48 54 55 56 57 58 59 68; U4 2 3 9 10 11; U13 12; U14 1; U15 4; U31 2; U35 1 2 3 4; U36 1 2 3 4; U42 2; USB1 3 9 13 14

## Routing (per net, layer and track width the routed paths; a pad name or vN(x,y) marks a point on that pad's centre or on a via; arc(x,y) is an arc through that point)
1.1V: length 24.3
  Top Layer w0.254: 21.51,68.31 21.51,68.08 20.98,67.55 ; 21.51,68.31 21.51,72.74 23.5,74.73 23.5,75.41 22.63,76.27 ; 21.51,68.31 28.08,68.31 ; 27.91,74.48 27.18,73.76 27.18,73.46 28.08,72.55 28.08,68.31 ; 28.66,68 28.35,68.31 28.08,68.31
3.3V: length 60.7
  Top Layer w0.254: 26.95,65.2 26.95,64.97 25.3,63.32 23.98,63.32 21.31,65.99 ; 26.95,65.2 26.95,65.35 28.42,66.83 ; 26.95,65.2 26.41,65.74 U1.24 ; 22.49,66.24 22.24,65.99 21.31,65.99 ; 20.21,75.25 21.62,76.66 22.81,76.66 23.08,76.39 ; 20.21,75.25 21.4,75.25 21.71,74.94 ; 20.21,75.25 18.92,73.97 ; 26.87,34.03 26.87,36.58 26.69,36.76 26.59,36.76 26.35,37 25.51,37 U4.5 ; 26.87,34.03 26.87,33.45 25.32,31.9 25.19,31.9 U3.B3 ; 26.87,34.03 22.74,34.03 22.56,34.21 22.56,35.88 23.18,36.5 23.51,36.5 U4.8 ; 21.31,65.99 18.67,68.63 ; 19.56,73.12 18.92,73.76 18.92,73.97 ; 27.68,67.27 28.12,66.83 28.42,66.83 ; 31.75,72.19 32.51,71.42 32.51,70.92 28.42,66.83 ; 31.75,72.19 31.27,72.19 30.88,71.8 ; 31.75,72.19 29.25,74.68 28.67,74.68 28.32,74.33 ; 18.67,68.63 19.22,68.63 19.67,69.08 ; 18.67,68.63 16.76,70.54 16.76,71.81 18.92,73.97
+5V: length 54.5
  Top Layer w0.508: U38.11 41.35,4.06 42.29,5 42.29,9.64 U32.3 ; U37.11 17.7,4.06 19.18,2.59 31.17,2.59 U38.2
  Bottom Layer w0.508: U33.8 7.87,9.23 7.87,5.84 U37.2 U37.5 U37.8 U37.11 ; U38.2 U38.5 U38.8 U38.11
GND: length 155
  Top Layer w0.254: 23.56,77.04 23.58,77.04 24.66,75.95 24.66,71.2 24.51,71.04 ; U42.3 18.79,35.26 22.2,31.85 ; U3.B2 U3.B1 22.23,31.88 22.2,31.85 ; 22.2,31.85 23.72,30.33 24.99,30.33 25.16,30.51 U3.C3 33.88,31.48 U40.3 ; U5.8 U5.9 24.76,42.24 21.24,45.77 21.16,45.85 19.51,45.85 18.9,46.46 18.9,47.66 16.91,47.66 ; U4.7 U4.6 24.76,37.9 24.26,38.4 U5.3
  Top Layer w0.508: U33.7 1.27,14.74 1.27,6.27 2.41,5.13 4.95,5.13 8.56,1.52 U37.1
  Bottom Layer w0.254: U6.2 34.3,74.72 36,76.42 ; U13.13 U13.14 ; U13.22 U13.21
  Bottom Layer w0.508: U39.2 18.09,12.08 18.36,12.35 18.36,12.62 18.57,12.84 18.84,12.84 18.99,12.99 20.51,12.99 U13.8 U13.23 U13.22 U13.19 U13.20 U13.17 U13.16 ; U38.1 29.82,4.34 U34.1 ; U38.1 U38.4 U38.7 U38.10 ; U38.1 U37.10 U37.7 U37.4 U37.1 ; U33.7 5.19,18.65 8.7,18.65 9.32,18.04 9.68,18.04 arc(10.27,18.2) 10.88,18.16 ; U13.14 U13.21 U13.18 U13.15 U13.3 ; U13.9 18.76,18.16 10.88,18.16 ; 10.88,18.16 10.78,18.16 ; 10.88,18.16 arc(10.9,18.13) 10.87,18.11
VCC: length 42
  Top Layer w0.762: U34.2 17.96,8.61 5.14,8.61 U33.9
  Bottom Layer w0.508: U39.4 U39.3
  Bottom Layer w0.762: U39.3 17.13,9.43 U34.2 22.91,4.34 U13.1 U13.2
$3N2422: length 2.3
  Bottom Layer w0.508: U13.5 U13.6
